# Altium project COMRAD_0v1.PrjPCB (part 2 of 5)

## Sheet ZYNQ_Power.SchDoc
size A3; DocumentNumber: 11; SheetNumber: 11; SheetTotal: 47
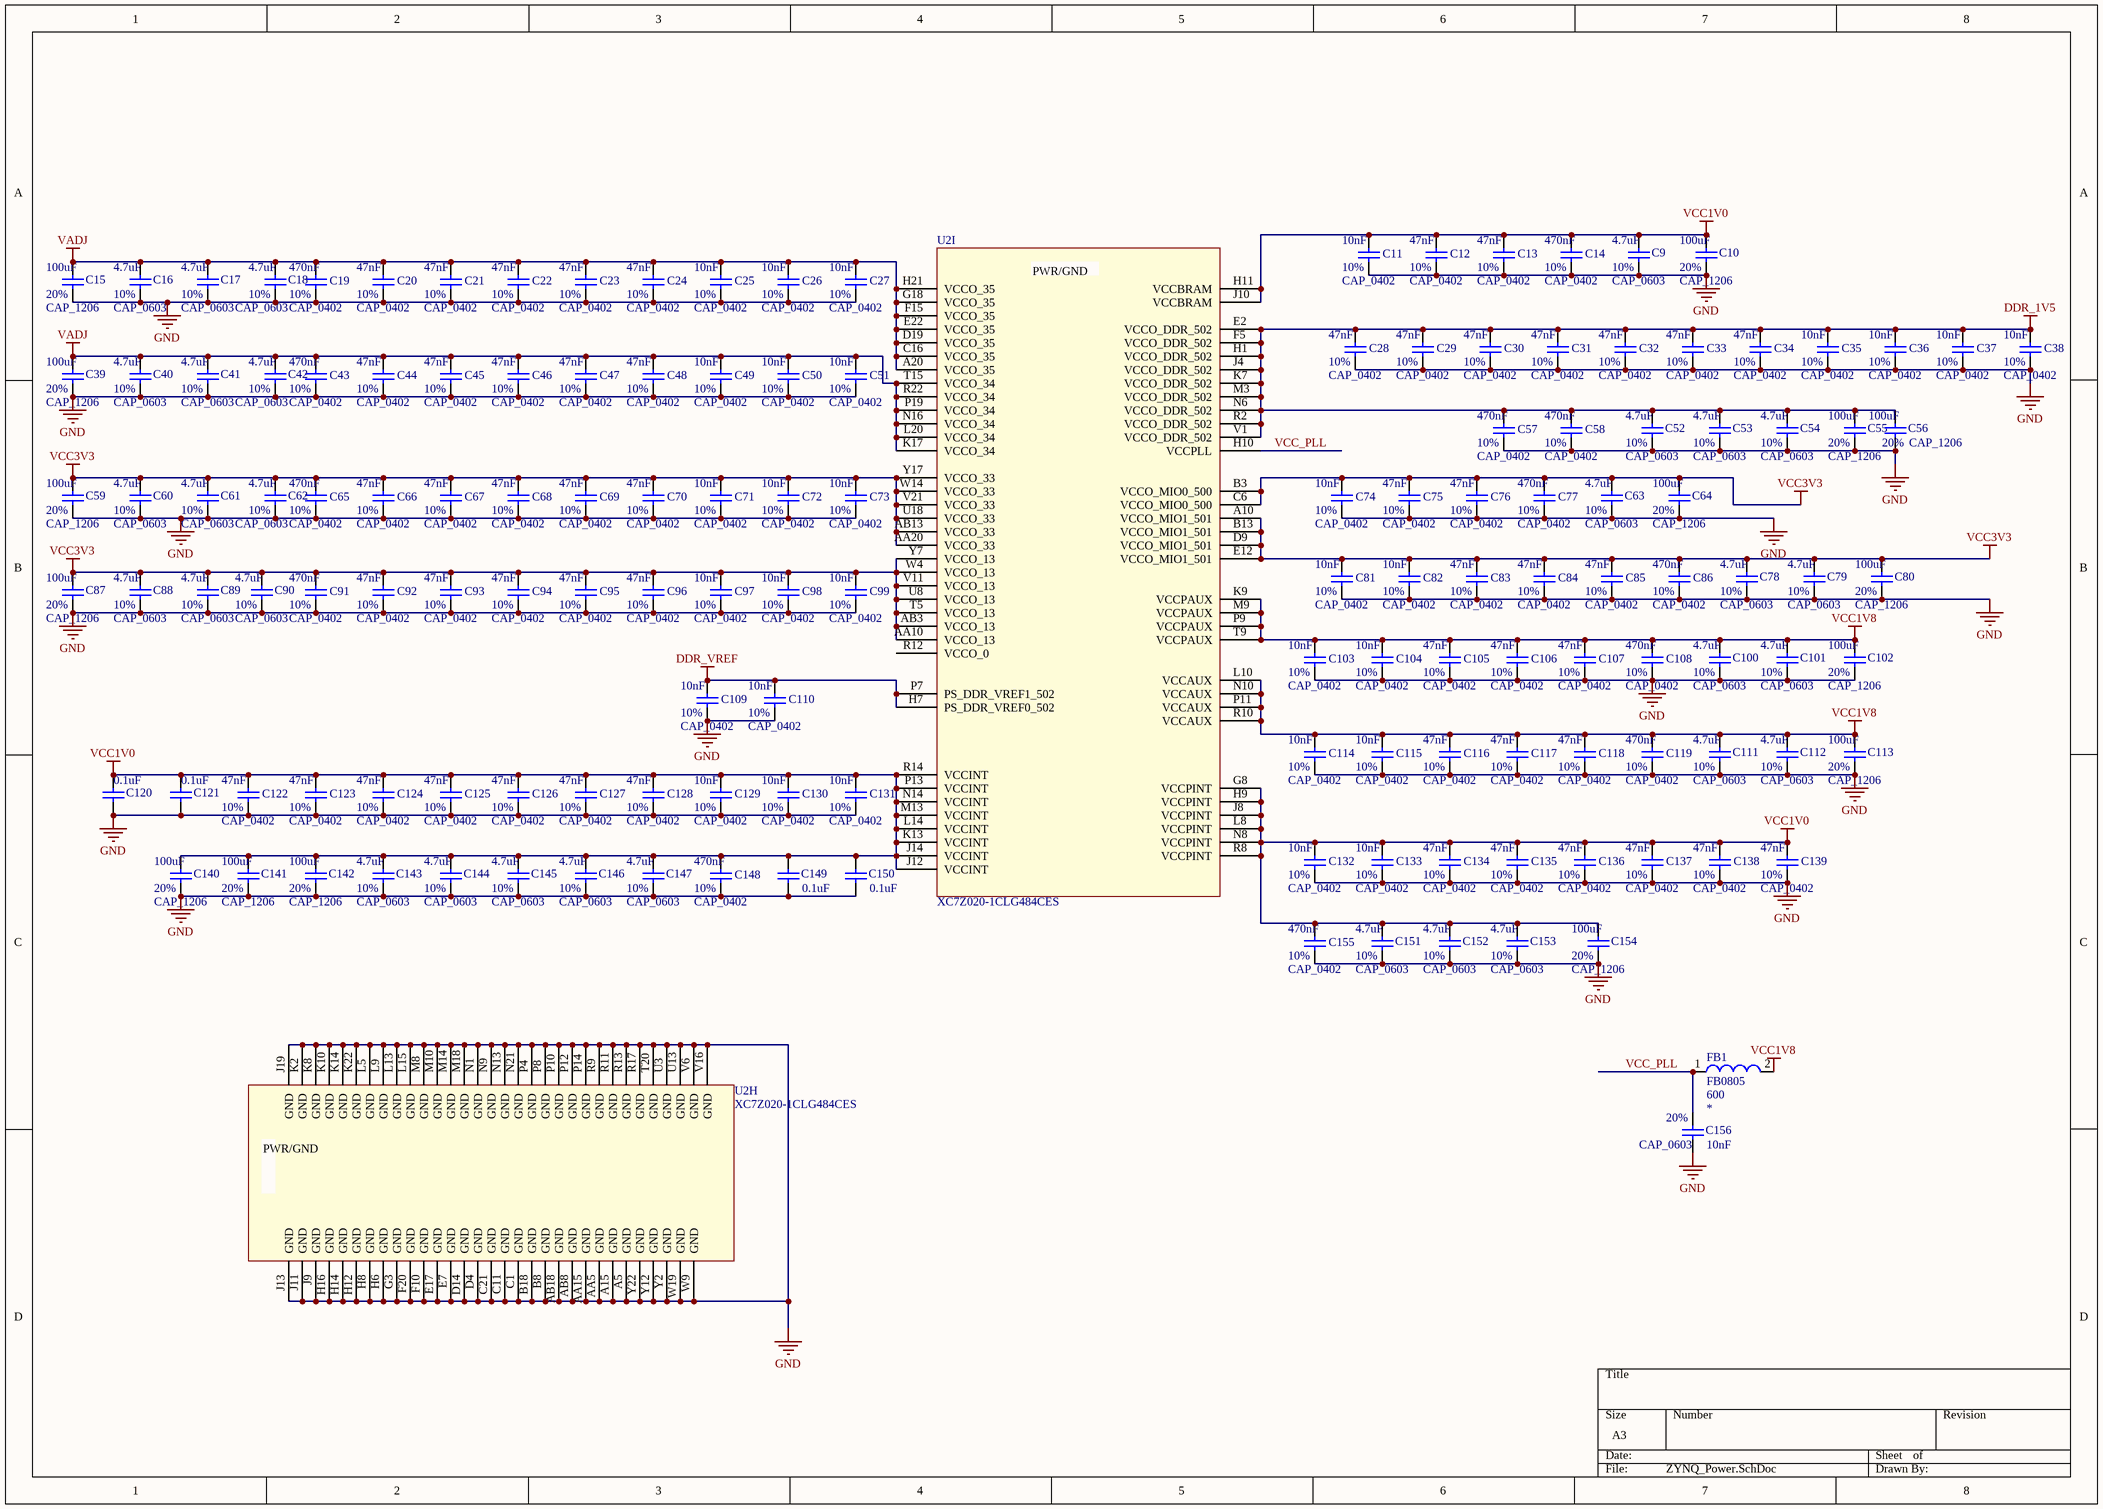
[diagram p9: ZYNQ_Power.SchDoc]

### Parts
C9  CAP_0603  value 4.7uF  Tolerance: 10%  [CAPC0603(1608)100_N]
C10  CAP_1206  value 100uF  Tolerance: 20%  [CAPC1206(3216)100_N]
C11  CAP_0402  value 10nF  Tolerance: 10%  [CAPC0402(1005)60_N]
C12  CAP_0402  value 47nF  Tolerance: 10%  [CAPC0402(1005)60_N]
C13  CAP_0402  value 47nF  Tolerance: 10%  [CAPC0402(1005)60_N]
C14  CAP_0402  value 470nF  Tolerance: 10%  [CAPC0402(1005)60_N]
C15  CAP_1206  value 100uF  Tolerance: 20%  [CAPC1206(3216)100_N]
C16  CAP_0603  value 4.7uF  Tolerance: 10%  [CAPC0603(1608)100_N]
C17  CAP_0603  value 4.7uF  Tolerance: 10%  [CAPC0603(1608)100_N]
C18  CAP_0603  value 4.7uF  Tolerance: 10%  [CAPC0603(1608)100_N]
C19  CAP_0402  value 470nF  Tolerance: 10%  [CAPC0402(1005)60_N]
C20  CAP_0402  value 47nF  Tolerance: 10%  [CAPC0402(1005)60_N]
C21  CAP_0402  value 47nF  Tolerance: 10%  [CAPC0402(1005)60_N]
C22  CAP_0402  value 47nF  Tolerance: 10%  [CAPC0402(1005)60_N]
C23  CAP_0402  value 47nF  Tolerance: 10%  [CAPC0402(1005)60_N]
C24  CAP_0402  value 47nF  Tolerance: 10%  [CAPC0402(1005)60_N]
C25  CAP_0402  value 10nF  Tolerance: 10%  [CAPC0402(1005)60_N]
C26  CAP_0402  value 10nF  Tolerance: 10%  [CAPC0402(1005)60_N]
C27  CAP_0402  value 10nF  Tolerance: 10%  [CAPC0402(1005)60_N]
C28  CAP_0402  value 47nF  Tolerance: 10%  [CAPC0402(1005)60_N]
C29  CAP_0402  value 47nF  Tolerance: 10%  [CAPC0402(1005)60_N]
C30  CAP_0402  value 47nF  Tolerance: 10%  [CAPC0402(1005)60_N]
C31  CAP_0402  value 47nF  Tolerance: 10%  [CAPC0402(1005)60_N]
C32  CAP_0402  value 47nF  Tolerance: 10%  [CAPC0402(1005)60_N]
C33  CAP_0402  value 47nF  Tolerance: 10%  [CAPC0402(1005)60_N]
C34  CAP_0402  value 47nF  Tolerance: 10%  [CAPC0402(1005)60_N]
C35  CAP_0402  value 10nF  Tolerance: 10%  [CAPC0402(1005)60_N]
C36  CAP_0402  value 10nF  Tolerance: 10%  [CAPC0402(1005)60_N]
C37  CAP_0402  value 10nF  Tolerance: 10%  [CAPC0402(1005)60_N]
C38  CAP_0402  value 10nF  Tolerance: 10%  [CAPC0402(1005)60_N]
C39  CAP_1206  value 100uF  Tolerance: 20%  [CAPC1206(3216)100_N]
C40  CAP_0603  value 4.7uF  Tolerance: 10%  [CAPC0603(1608)100_N]
C41  CAP_0603  value 4.7uF  Tolerance: 10%  [CAPC0603(1608)100_N]
C42  CAP_0603  value 4.7uF  Tolerance: 10%  [CAPC0603(1608)100_N]
C43  CAP_0402  value 470nF  Tolerance: 10%  [CAPC0402(1005)60_N]
C44  CAP_0402  value 47nF  Tolerance: 10%  [CAPC0402(1005)60_N]
C45  CAP_0402  value 47nF  Tolerance: 10%  [CAPC0402(1005)60_N]
C46  CAP_0402  value 47nF  Tolerance: 10%  [CAPC0402(1005)60_N]
C47  CAP_0402  value 47nF  Tolerance: 10%  [CAPC0402(1005)60_N]
C48  CAP_0402  value 47nF  Tolerance: 10%  [CAPC0402(1005)60_N]
C49  CAP_0402  value 10nF  Tolerance: 10%  [CAPC0402(1005)60_N]
C50  CAP_0402  value 10nF  Tolerance: 10%  [CAPC0402(1005)60_N]
C51  CAP_0402  value 10nF  Tolerance: 10%  [CAPC0402(1005)60_N]
C52  CAP_0603  value 4.7uF  Tolerance: 10%  [CAPC0603(1608)100_N]
C53  CAP_0603  value 4.7uF  Tolerance: 10%  [CAPC0603(1608)100_N]
C54  CAP_0603  value 4.7uF  Tolerance: 10%  [CAPC0603(1608)100_N]
C55  CAP_1206  value 100uF  Tolerance: 20%  [CAPC1206(3216)100_N]
C56  CAP_1206  value 100uF  Tolerance: 20%  [CAPC1206(3216)100_N]
C57  CAP_0402  value 470nF  Tolerance: 10%  [CAPC0402(1005)60_N]
C58  CAP_0402  value 470nF  Tolerance: 10%  [CAPC0402(1005)60_N]
C59  CAP_1206  value 100uF  Tolerance: 20%  [CAPC1206(3216)100_N]
C60  CAP_0603  value 4.7uF  Tolerance: 10%  [CAPC0603(1608)100_N]
C61  CAP_0603  value 4.7uF  Tolerance: 10%  [CAPC0603(1608)100_N]
C62  CAP_0603  value 4.7uF  Tolerance: 10%  [CAPC0603(1608)100_N]
C63  CAP_0603  value 4.7uF  Tolerance: 10%  [CAPC0603(1608)100_N]
C64  CAP_1206  value 100uF  Tolerance: 20%  [CAPC1206(3216)100_N]
C65  CAP_0402  value 470nF  Tolerance: 10%  [CAPC0402(1005)60_N]
C66  CAP_0402  value 47nF  Tolerance: 10%  [CAPC0402(1005)60_N]
C67  CAP_0402  value 47nF  Tolerance: 10%  [CAPC0402(1005)60_N]
C68  CAP_0402  value 47nF  Tolerance: 10%  [CAPC0402(1005)60_N]
C69  CAP_0402  value 47nF  Tolerance: 10%  [CAPC0402(1005)60_N]
C70  CAP_0402  value 47nF  Tolerance: 10%  [CAPC0402(1005)60_N]
C71  CAP_0402  value 10nF  Tolerance: 10%  [CAPC0402(1005)60_N]
C72  CAP_0402  value 10nF  Tolerance: 10%  [CAPC0402(1005)60_N]
C73  CAP_0402  value 10nF  Tolerance: 10%  [CAPC0402(1005)60_N]
C74  CAP_0402  value 10nF  Tolerance: 10%  [CAPC0402(1005)60_N]
C75  CAP_0402  value 47nF  Tolerance: 10%  [CAPC0402(1005)60_N]
C76  CAP_0402  value 47nF  Tolerance: 10%  [CAPC0402(1005)60_N]
C77  CAP_0402  value 470nF  Tolerance: 10%  [CAPC0402(1005)60_N]
C78  CAP_0603  value 4.7uF  Tolerance: 10%  [CAPC0603(1608)100_N]
C79  CAP_0603  value 4.7uF  Tolerance: 10%  [CAPC0603(1608)100_N]
C80  CAP_1206  value 100uF  Tolerance: 20%  [CAPC1206(3216)100_N]
C81  CAP_0402  value 10nF  Tolerance: 10%  [CAPC0402(1005)60_N]
C82  CAP_0402  value 10nF  Tolerance: 10%  [CAPC0402(1005)60_N]
C83  CAP_0402  value 47nF  Tolerance: 10%  [CAPC0402(1005)60_N]
C84  CAP_0402  value 47nF  Tolerance: 10%  [CAPC0402(1005)60_N]
C85  CAP_0402  value 47nF  Tolerance: 10%  [CAPC0402(1005)60_N]
C86  CAP_0402  value 470nF  Tolerance: 10%  [CAPC0402(1005)60_N]
C87  CAP_1206  value 100uF  Tolerance: 20%  [CAPC1206(3216)100_N]
C88  CAP_0603  value 4.7uF  Tolerance: 10%  [CAPC0603(1608)100_N]
C89  CAP_0603  value 4.7uF  Tolerance: 10%  [CAPC0603(1608)100_N]
C90  CAP_0603  value 4.7uF  Tolerance: 10%  [CAPC0603(1608)100_N]
C91  CAP_0402  value 470nF  Tolerance: 10%  [CAPC0402(1005)60_N]
C92  CAP_0402  value 47nF  Tolerance: 10%  [CAPC0402(1005)60_N]
C93  CAP_0402  value 47nF  Tolerance: 10%  [CAPC0402(1005)60_N]
C94  CAP_0402  value 47nF  Tolerance: 10%  [CAPC0402(1005)60_N]
C95  CAP_0402  value 47nF  Tolerance: 10%  [CAPC0402(1005)60_N]
C96  CAP_0402  value 47nF  Tolerance: 10%  [CAPC0402(1005)60_N]
C97  CAP_0402  value 10nF  Tolerance: 10%  [CAPC0402(1005)60_N]
C98  CAP_0402  value 10nF  Tolerance: 10%  [CAPC0402(1005)60_N]
C99  CAP_0402  value 10nF  Tolerance: 10%  [CAPC0402(1005)60_N]
C100  CAP_0603  value 4.7uF  Tolerance: 10%  [CAPC0603(1608)100_N]
C101  CAP_0603  value 4.7uF  Tolerance: 10%  [CAPC0603(1608)100_N]
C102  CAP_1206  value 100uF  Tolerance: 20%  [CAPC1206(3216)100_N]
C103  CAP_0402  value 10nF  Tolerance: 10%  [CAPC0402(1005)60_N]
C104  CAP_0402  value 10nF  Tolerance: 10%  [CAPC0402(1005)60_N]
C105  CAP_0402  value 47nF  Tolerance: 10%  [CAPC0402(1005)60_N]
C106  CAP_0402  value 47nF  Tolerance: 10%  [CAPC0402(1005)60_N]
C107  CAP_0402  value 47nF  Tolerance: 10%  [CAPC0402(1005)60_N]
C108  CAP_0402  value 470nF  Tolerance: 10%  [CAPC0402(1005)60_N]
C109  CAP_0402  value 10nF  Tolerance: 10%  [CAPC0402(1005)60_N]
C110  CAP_0402  value 10nF  Tolerance: 10%  [CAPC0402(1005)60_N]
C111  CAP_0603  value 4.7uF  Tolerance: 10%  [CAPC0603(1608)100_N]
C112  CAP_0603  value 4.7uF  Tolerance: 10%  [CAPC0603(1608)100_N]
C113  CAP_1206  value 100uF  Tolerance: 20%  [CAPC1206(3216)100_N]
C114  CAP_0402  value 10nF  Tolerance: 10%  [CAPC0402(1005)60_N]
C115  CAP_0402  value 10nF  Tolerance: 10%  [CAPC0402(1005)60_N]
C116  CAP_0402  value 47nF  Tolerance: 10%  [CAPC0402(1005)60_N]
C117  CAP_0402  value 47nF  Tolerance: 10%  [CAPC0402(1005)60_N]
C118  CAP_0402  value 47nF  Tolerance: 10%  [CAPC0402(1005)60_N]
C119  CAP_0402  value 470nF  Tolerance: 10%  [CAPC0402(1005)60_N]
C120  value 0.1uF  [CAPC0402(1005)60_N]  (hidden comment: TMK105BJ104KV-F)
C121  value 0.1uF  [CAPC0402(1005)60_N]  (hidden comment: TMK105BJ104KV-F)
C122  CAP_0402  value 47nF  Tolerance: 10%  [CAPC0402(1005)60_N]
C123  CAP_0402  value 47nF  Tolerance: 10%  [CAPC0402(1005)60_N]
C124  CAP_0402  value 47nF  Tolerance: 10%  [CAPC0402(1005)60_N]
C125  CAP_0402  value 47nF  Tolerance: 10%  [CAPC0402(1005)60_N]
C126  CAP_0402  value 47nF  Tolerance: 10%  [CAPC0402(1005)60_N]
C127  CAP_0402  value 47nF  Tolerance: 10%  [CAPC0402(1005)60_N]
C128  CAP_0402  value 47nF  Tolerance: 10%  [CAPC0402(1005)60_N]
C129  CAP_0402  value 10nF  Tolerance: 10%  [CAPC0402(1005)60_N]
C130  CAP_0402  value 10nF  Tolerance: 10%  [CAPC0402(1005)60_N]
C131  CAP_0402  value 10nF  Tolerance: 10%  [CAPC0402(1005)60_N]
C132  CAP_0402  value 10nF  Tolerance: 10%  [CAPC0402(1005)60_N]
C133  CAP_0402  value 10nF  Tolerance: 10%  [CAPC0402(1005)60_N]
C134  CAP_0402  value 47nF  Tolerance: 10%  [CAPC0402(1005)60_N]
C135  CAP_0402  value 47nF  Tolerance: 10%  [CAPC0402(1005)60_N]
C136  CAP_0402  value 47nF  Tolerance: 10%  [CAPC0402(1005)60_N]
C137  CAP_0402  value 47nF  Tolerance: 10%  [CAPC0402(1005)60_N]
C138  CAP_0402  value 47nF  Tolerance: 10%  [CAPC0402(1005)60_N]
C139  CAP_0402  value 47nF  Tolerance: 10%  [CAPC0402(1005)60_N]
C140  CAP_1206  value 100uF  Tolerance: 20%  [CAPC1206(3216)100_N]
C141  CAP_1206  value 100uF  Tolerance: 20%  [CAPC1206(3216)100_N]
C142  CAP_1206  value 100uF  Tolerance: 20%  [CAPC1206(3216)100_N]
C143  CAP_0603  value 4.7uF  Tolerance: 10%  [CAPC0603(1608)100_N]
C144  CAP_0603  value 4.7uF  Tolerance: 10%  [CAPC0603(1608)100_N]
C145  CAP_0603  value 4.7uF  Tolerance: 10%  [CAPC0603(1608)100_N]
C146  CAP_0603  value 4.7uF  Tolerance: 10%  [CAPC0603(1608)100_N]
C147  CAP_0603  value 4.7uF  Tolerance: 10%  [CAPC0603(1608)100_N]
C148  CAP_0402  value 470nF  Tolerance: 10%  [CAPC0402(1005)60_N]
C149  value 0.1uF  [CAPC0402(1005)60_N]  (hidden comment: TMK105BJ104KV-F)
C150  value 0.1uF  [CAPC0402(1005)60_N]  (hidden comment: TMK105BJ104KV-F)
C151  CAP_0603  value 4.7uF  Tolerance: 10%  [CAPC0603(1608)100_N]
C152  CAP_0603  value 4.7uF  Tolerance: 10%  [CAPC0603(1608)100_N]
C153  CAP_0603  value 4.7uF  Tolerance: 10%  [CAPC0603(1608)100_N]
C154  CAP_1206  value 100uF  Tolerance: 20%  [CAPC1206(3216)100_N]
C155  CAP_0402  value 470nF  Tolerance: 10%  [CAPC0402(1005)60_N]
C156  CAP_0603  value 10nF  Tolerance: 20%  [CAPC0402(1005)60_N]
FB1  FB0805  Resistance: 600  [Inductor0805(2012)]
U2  XC7Z020-1CLG484CES  [ZYNQ_xc7z020clg484pkg_BGA-484]  (parts H,I of 10)

### Nets
DDR_1V5: C28.2 C29.2 C30.2 C31.2 C32.2 C33.2 C34.2 C35.2 C36.2 C37.2 C38.2 C52.2 C53.2 C54.2 C55.2 C56.2 C57.2 C58.2 U2.E2(VCCO_DDR_502) U2.F5(VCCO_DDR_502) U2.H1(VCCO_DDR_502) U2.J4(VCCO_DDR_502) U2.K7(VCCO_DDR_502) U2.M3(VCCO_DDR_502) U2.N6(VCCO_DDR_502) U2.R2(VCCO_DDR_502) U2.V1(VCCO_DDR_502)
DDR_VREF: C109.2 C110.2 U2.H7(PS_DDR_VREF0_502) U2.P7(PS_DDR_VREF1_502)
GND: C9.1 C10.1 C11.1 C12.1 C13.1 C14.1 C15.1 C16.1 C17.1 C18.1 C19.1 C20.1 C21.1 C22.1 C23.1 C24.1 C25.1 C26.1 C27.1 C28.1 C29.1 C30.1 C31.1 C32.1 C33.1 C34.1 C35.1 C36.1 C37.1 C38.1 C39.1 C40.1 C41.1 C42.1 C43.1 C44.1 C45.1 C46.1 C47.1 C48.1 C49.1 C50.1 C51.1 C52.1 C53.1 C54.1 C55.1 C56.1 C57.1 C58.1 C59.1 C60.1 C61.1 C62.1 C63.1 C64.1 C65.1 C66.1 C67.1 C68.1 C69.1 C70.1 C71.1 C72.1 C73.1 C74.1 C75.1 C76.1 C77.1 C78.1 C79.1 C80.1 C81.1 C82.1 C83.1 C84.1 C85.1 C86.1 C87.1 C88.1 C89.1 C90.1 C91.1 C92.1 C93.1 C94.1 C95.1 C96.1 C97.1 C98.1 C99.1 C100.1 C101.1 C102.1 C103.1 C104.1 C105.1 C106.1 C107.1 C108.1 C109.1 C110.1 C111.1 C112.1 C113.1 C114.1 C115.1 C116.1 C117.1 C118.1 C119.1 C120.1 C121.1 C122.1 C123.1 C124.1 C125.1 C126.1 C127.1 C128.1 C129.1 C130.1 C131.1 C132.1 C133.1 C134.1 C135.1 C136.1 C137.1 C138.1 C139.1 C140.1 C141.1 C142.1 C143.1 C144.1 C145.1 C146.1 C147.1 C148.1 C149.1 C150.1 C151.1 C152.1 C153.1 C154.1 C155.1 C156.1 U2.A5(GND) U2.A15(GND) U2.AA5(GND) U2.AA15(GND) U2.AB8(GND) U2.AB18(GND) U2.B8(GND) U2.B18(GND) U2.C1(GND) U2.C11(GND) U2.C21(GND) U2.D4(GND) U2.D14(GND) U2.E7(GND) U2.E17(GND) U2.F10(GND) U2.F20(GND) U2.G3(GND) U2.H6(GND) U2.H8(GND) U2.H12(GND) U2.H14(GND) U2.H16(GND) U2.J9(GND) U2.J11(GND) U2.J13(GND) U2.J19(GND) U2.K2(GND) U2.K8(GND) U2.K10(GND) U2.K14(GND) U2.K22(GND) U2.L5(GND) U2.L9(GND) U2.L13(GND) U2.L15(GND) U2.M8(GND) U2.M10(GND) U2.M14(GND) U2.M18(GND) U2.N1(GND) U2.N9(GND) U2.N13(GND) U2.N21(GND) U2.P4(GND) U2.P8(GND) U2.P10(GND) U2.P12(GND) U2.P14(GND) U2.R9(GND) U2.R11(GND) U2.R13(GND) U2.R17(GND) U2.T20(GND) U2.U3(GND) U2.U13(GND) U2.V6(GND) U2.V16(GND) U2.W9(GND) U2.W19(GND) U2.Y2(GND) U2.Y12(GND) U2.Y22(GND)
VADJ: C15.2 C16.2 C17.2 C18.2 C19.2 C20.2 C21.2 C22.2 C23.2 C24.2 C25.2 C26.2 C27.2 C39.2 C40.2 C41.2 C42.2 C43.2 C44.2 C45.2 C46.2 C47.2 C48.2 C49.2 C50.2 C51.2 U2.A20(VCCO_35) U2.C16(VCCO_35) U2.D19(VCCO_35) U2.E22(VCCO_35) U2.F15(VCCO_35) U2.G18(VCCO_35) U2.H21(VCCO_35) U2.K17(VCCO_34) U2.L20(VCCO_34) U2.N16(VCCO_34) U2.P19(VCCO_34) U2.R22(VCCO_34) U2.T15(VCCO_34)
VCC1V0: C9.2 C10.2 C11.2 C12.2 C13.2 C14.2 C120.2 C121.2 C122.2 C123.2 C124.2 C125.2 C126.2 C127.2 C128.2 C129.2 C130.2 C131.2 C132.2 C133.2 C134.2 C135.2 C136.2 C137.2 C138.2 C139.2 C140.2 C141.2 C142.2 C143.2 C144.2 C145.2 C146.2 C147.2 C148.2 C149.2 C150.2 C151.2 C152.2 C153.2 C154.2 C155.2 U2.G8(VCCPINT) U2.H9(VCCPINT) U2.H11(VCCBRAM) U2.J8(VCCPINT) U2.J10(VCCBRAM) U2.J12(VCCINT) U2.J14(VCCINT) U2.K13(VCCINT) U2.L8(VCCPINT) U2.L14(VCCINT) U2.M13(VCCINT) U2.N8(VCCPINT) U2.N14(VCCINT) U2.P13(VCCINT) U2.R8(VCCPINT) U2.R14(VCCINT)
VCC1V8: C100.2 C101.2 C102.2 C103.2 C104.2 C105.2 C106.2 C107.2 C108.2 C111.2 C112.2 C113.2 C114.2 C115.2 C116.2 C117.2 C118.2 C119.2 FB1.2 U2.K9(VCCPAUX) U2.L10(VCCAUX) U2.M9(VCCPAUX) U2.N10(VCCAUX) U2.P9(VCCPAUX) U2.P11(VCCAUX) U2.R10(VCCAUX) U2.T9(VCCPAUX)  [project net A_VCC1V8]
VCC3V3: C59.2 C60.2 C61.2 C62.2 C63.2 C64.2 C65.2 C66.2 C67.2 C68.2 C69.2 C70.2 C71.2 C72.2 C73.2 C74.2 C75.2 C76.2 C77.2 C78.2 C79.2 C80.2 C81.2 C82.2 C83.2 C84.2 C85.2 C86.2 C87.2 C88.2 C89.2 C90.2 C91.2 C92.2 C93.2 C94.2 C95.2 C96.2 C97.2 C98.2 C99.2 U2.A10(VCCO_MIO1_501) U2.AA10(VCCO_13) U2.AA20(VCCO_33) U2.AB3(VCCO_13) U2.AB13(VCCO_33) U2.B3(VCCO_MIO0_500) U2.B13(VCCO_MIO1_501) U2.C6(VCCO_MIO0_500) U2.D9(VCCO_MIO1_501) U2.E12(VCCO_MIO1_501) U2.T5(VCCO_13) U2.U8(VCCO_13) U2.U18(VCCO_33) U2.V11(VCCO_13) U2.V21(VCCO_33) U2.W4(VCCO_13) U2.W14(VCCO_33) U2.Y7(VCCO_13) U2.Y17(VCCO_33)
VCC_PLL: C156.2 FB1.1 U2.H10(VCCPLL)

Not connected (* = marked no-connect by the designer): U2 R12(VCCO_0)

### Notes on the sheet
- (in symbol XC7Z020-1CLG484CES, part H) PWR/GND
- (in symbol XC7Z020-1CLG484CES, part I) PWR/GND

### Library data of the parts
C9 C16-C18 C40-C42 C52-C54 C60-C63 C78 C79 C88-C90 C100 C101 C111 C112 C143-C147 C151-C153 = CAP_0603: 4.7uF, ceramic, 10% 6.3V X5R Low ESR, 0603; Part Number: GRM188R60J475KE19D; Manufacturer: Murata Electronics North America; Footprint Ref: CAPC0603(1608)100_N; Library Ref: CAP_0603
C10 C15 C39 C55 C56 C59 C64 C80 C87 C102 C113 C140-C142 C154 = CAP_1206: CAP CER 100UF 6.3V 20% X5R 1206; Part Number: JMK316BJ107ML-T; Manufacturer: Taiyo Yuden; Footprint Ref: CAPC1206(3216)100_N; Library Ref: CAP_1206; Distributor: http://www.yuden.co.jp/productdata/catalog/en/mlcc01_e.pdf
C11 C25-C27 C35-C38 C49-C51 C71-C74 C81 C82 C97-C99 C103 C104 C109 C110 C114 C115 C129-C133 = CAP_0402: as C454 on sheet ZYNQ_MIOBank_500; Footprint Ref: CAPC0402(1005)60_N; Library Ref: CAP_0402
C12 C13 C20-C24 C28-C34 C44-C48 C66-C70 C75 C76 C83-C85 C92-C96 C105-C107 C116-C118 C122-C128 C134-C139 = CAP_0402: 0.047uF, ceramic, 10% 6.3V X5R, 0402; Part Number: GRM155R60J473KA01D; Manufacturer: Murata Electronics North America; Footprint Ref: CAPC0402(1005)60_N; Library Ref: CAP_0402
C14 C19 C43 C57 C58 C65 C77 C86 C91 C108 C119 C148 C155 = CAP_0402: 0.47uF, ceramic, 10% 6.3V X5R, 0402; Part Number: GRM155R60J474KE19D; Manufacturer: Murata Electronics North America; Footprint Ref: CAPC0402(1005)60_N; Library Ref: CAP_0402
C120 C121 C149 C150 = TMK105BJ104KV-F: 0.1uF, ceramic, 10%, 25V, X5R, 0402; Manufacturer: Taiyo Yuden; Tolerance: 10%; Part Number: TMK105BJ104KV-F
C156 = CAP_0603: 10000pF, ceramic, 10% 6.3V X5R, 0402; Part Number: GRM155R60J103KA01D; Manufacturer: Murata Electronics North America; Footprint Ref: CAPC0402(1005)60_N; Library Ref: CAP_0402
FB1 = FerriteBead0805: MPZ2012S601A, 600 ohm, 100MHz, 0805; Manufacturer: TDK Corporation; Value: 600; Max_Current: *; Part Number: MPZ2012S601A; Footprint Ref: Inductor0805(2012); Library Ref: FerriteBead0805
U2 = XC7Z020-1CLG484CES: as U2 on sheet ZYNQ_DDR3_Bank_502; Part Number: XC7Z020-1CLG484CES

## Sheet ZYNQ_CONFIG.SchDoc
size A4; DocumentNumber: 2; SheetNumber: 2; SheetTotal: 47
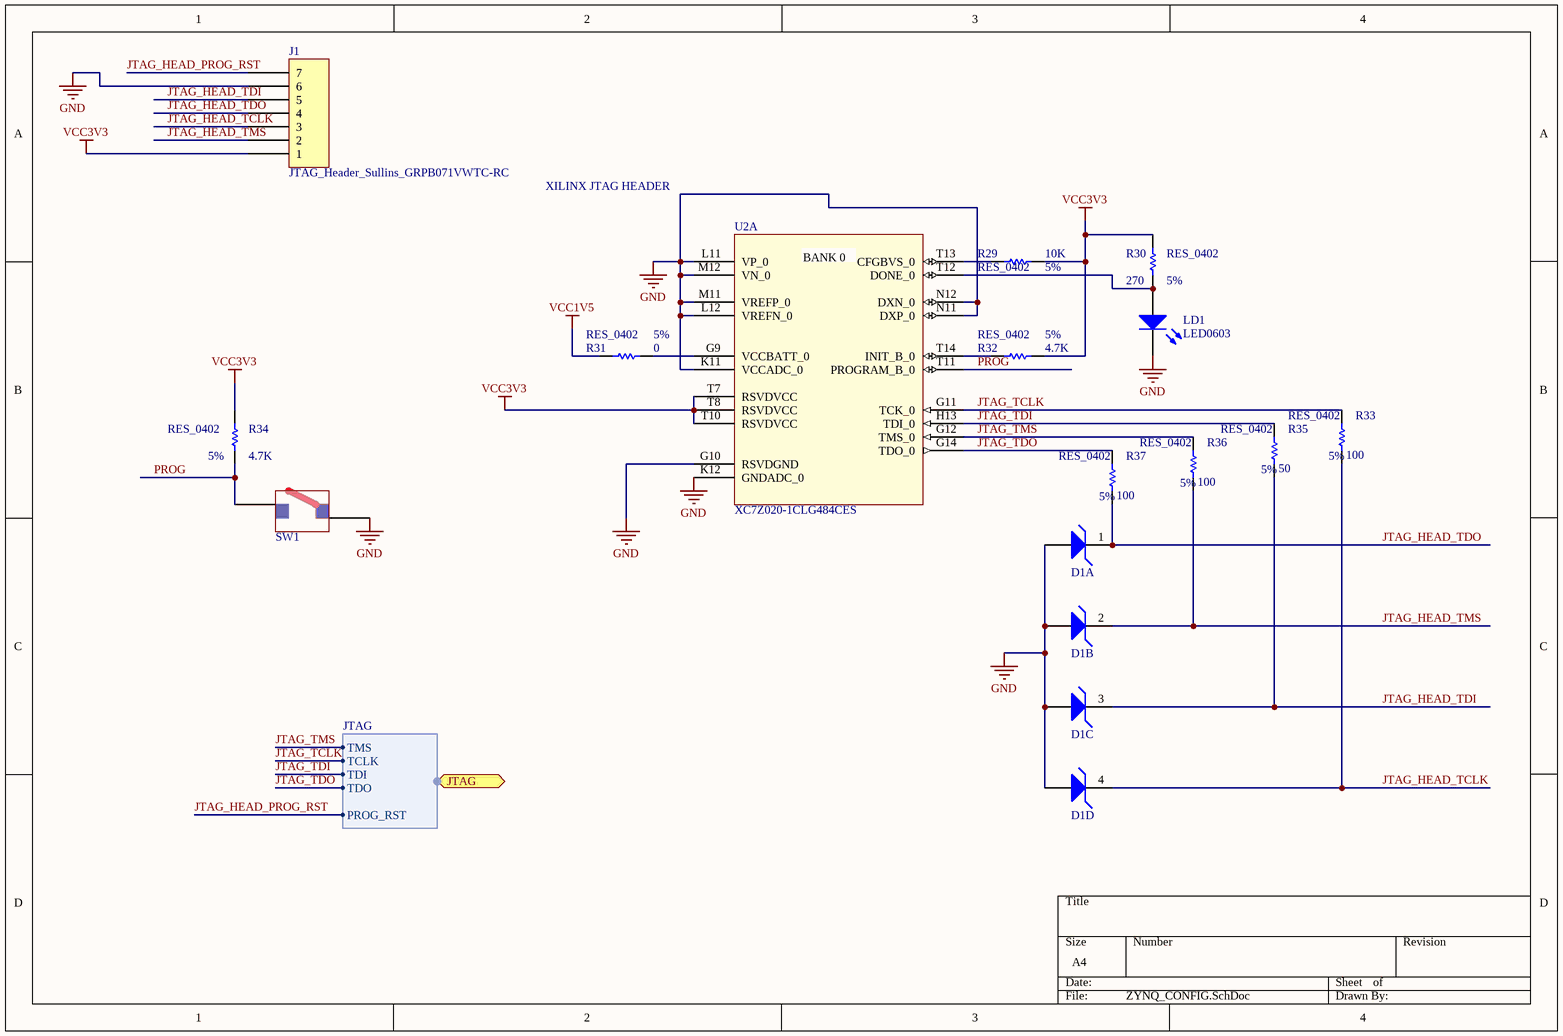
[diagram p10: ZYNQ_CONFIG.SchDoc]

### Parts
D1  QuadESDDiode_TEConnectivity_SESD0802Q4UG  [QuadESDDiode_TEConnectivity_SESD0802Q4UG_5-PIN]  (value not drawn)  (parts A,B,C,D of 4)
J1  JTAG_Header_Sullins_GRPB071VWTC-RC  [JTAG_Header_Sullins_GRPB071VWTC-RC_7-Pos]
LD1  LED0603  [LED0603(1608)]
R29  RES_0402  value 10K  Tolerance: 5%  [RESC0402(1005)_N]
R30  RES_0402  value 270  Tolerance: 5%  [RESC0402(1005)_N]
R31  RES_0402  value 0  Tolerance: 5%  [RESC0402(1005)_N]
R32  RES_0402  value 4.7K  Tolerance: 5%  [RESC0402(1005)_N]
R33  RES_0402  value 100  Tolerance: 5%  [RESC0402(1005)_N]
R34  RES_0402  value 4.7K  Tolerance: 5%  [RESC0402(1005)_N]
R35  RES_0402  value 50  Tolerance: 5%  [RESC0402(1005)_N]
R36  RES_0402  value 100  Tolerance: 5%  [RESC0402(1005)_N]
R37  RES_0402  value 100  Tolerance: 5%  [RESC0402(1005)_N]
SW1  CHS-01TB  [DIP_Switch_SPST_CopalElectronics_CHS-01TB]  (value not drawn)
U2  XC7Z020-1CLG484CES  [ZYNQ_xc7z020clg484pkg_BGA-484]  (part A of 10)

### Ports
JTAG (harness JTAG)

### Harnesses
JTAG: TMS, TCLK, TDI, TDO, PROG_RST

### Nets
GND: D1.G(A) J1.6 LD1.1(K) SW1.2 U2.G10(RSVDGND) U2.K11(VCCADC_0) U2.K12(GNDADC_0) U2.L11(VP_0) U2.L12(VREFN_0) U2.M11(VREFP_0) U2.M12(VN_0) U2.N11(DXP_0) U2.N12(DXN_0)
VCC1V5: R31.1
VCC3V3: J1.1 R29.2 R30.2 R32.2 R34.2 U2.T7(RSVDVCC) U2.T8(RSVDVCC) U2.T10(RSVDVCC)
JTAG_HEAD_PROG_RST: J1.7 ; port JTAG.PROG_RST
JTAG_HEAD_TCLK: D1.4(K) J1.3 R33.1
JTAG_HEAD_TDI: D1.3(K) J1.5 R35.1
JTAG_HEAD_TDO: D1.1(K) J1.4 R37.1
JTAG_HEAD_TMS: D1.2(K) J1.2 R36.1
JTAG_TCLK: R33.2 U2.G11(TCK_0) ; port JTAG.TCLK
JTAG_TDI: R35.2 U2.H13(TDI_0) ; port JTAG.TDI
JTAG_TDO: R37.2 U2.G14(TDO_0) ; port JTAG.TDO
JTAG_TMS: R36.2 U2.G12(TMS_0) ; port JTAG.TMS
PROG: R34.1 SW1.1 U2.T11(PROGRAM_B_0)
NetLD1_2: LD1.2(A) R30.1 U2.T12(DONE_0)
NetR29_1: R29.1 U2.T13(CFGBVS_0)
NetR31_2: R31.2 U2.G9(VCCBATT_0)
NetR32_1: R32.1 U2.T14(INIT_B_0)

### Notes on the sheet
- XILINX JTAG HEADER
- (in symbol XC7Z020-1CLG484CES, part A) BANK 0

### Library data of the parts
D1 = RF2197-000: SESD0802Q4UG, Quad Diode Array for ESD protection; Part Number: RF2197-000; Manufacturer: TE Connectivity
J1 = GRPB071VWTC-RC: CONN HEADER .050" 7POS SMD GOLD; Manufacturer: Sullins Connector Solutions; Part Number: GRPB071VWTC-RC
LD1 = LED0603: LED 565NM GRN DIFF 0603 SMD; Part Number: SML-LX0603GW-TR; Manufacturer: Lumex Opto/Components Inc; Value: GREEN; Footprint Ref: LED0603(1608); Library Ref: LED0603
R29 = RES_0402: 10K ohm, 5%, 1/16W, 0402; Part Number: RC0402JR-0710KL; Manufacturer: Yageo America; Library Ref: RES_0402; Footprint Ref: RESC0402(1005)_N
R30 = RES_0402: 270 ohm, 5%, 1/16W, 0402; Part Number: RC0402JR-07270RL; Manufacturer: Yageo America; Library Ref: RES_0402; Footprint Ref: RESC0402(1005)_N
R31 = RES_0402: 0.0 ohm shunt, 5%, 1/16W, 0402; Part Number: RC0402JR-070RL; Manufacturer: Yageo America; Library Ref: RES_0402; Footprint Ref: RESC0402(1005)_N
R32 R34 = RES_0402: 4.7K ohm, 5%, 1/16W, 0402; Part Number: RC0402JR-074K7L; Manufacturer: Yageo America; Library Ref: RES_0402; Footprint Ref: RESC0402(1005)_N
R33 R36 R37 = RES_0402: 100 ohm, 5%, 1/16W, 0402; Part Number: RC0402JR-07100RL; Manufacturer: Yageo America; Library Ref: RES_0402; Footprint Ref: RESC0402(1005)_N
R35 = RES_0402: 50 ohm, 5% 50mW, 0402; Part Number: FC0402E50R0JTBST1; Manufacturer: VISHAY SILICONIX; Library Ref: RES_0402; Footprint Ref: RESC0402(1005)_N
SW1 = CHS-01TB: SWITCH DIP 1-POS SLIDE SMD; Manufacturer: Copal Electronics Inc; Part Number: CHS-01TB
U2 = XC7Z020-1CLG484CES: XC7Z020-1CLG484CES, Zynq-7000 All Programmable SoC; Manufacturer: Xilinx; Part Number: XC7Z020-1CLG484CES

## Sheet ETHERNET_TOP_LEVEL.SchDoc
size A4; DocumentNumber: 42; SheetNumber: 42; SheetTotal: 47
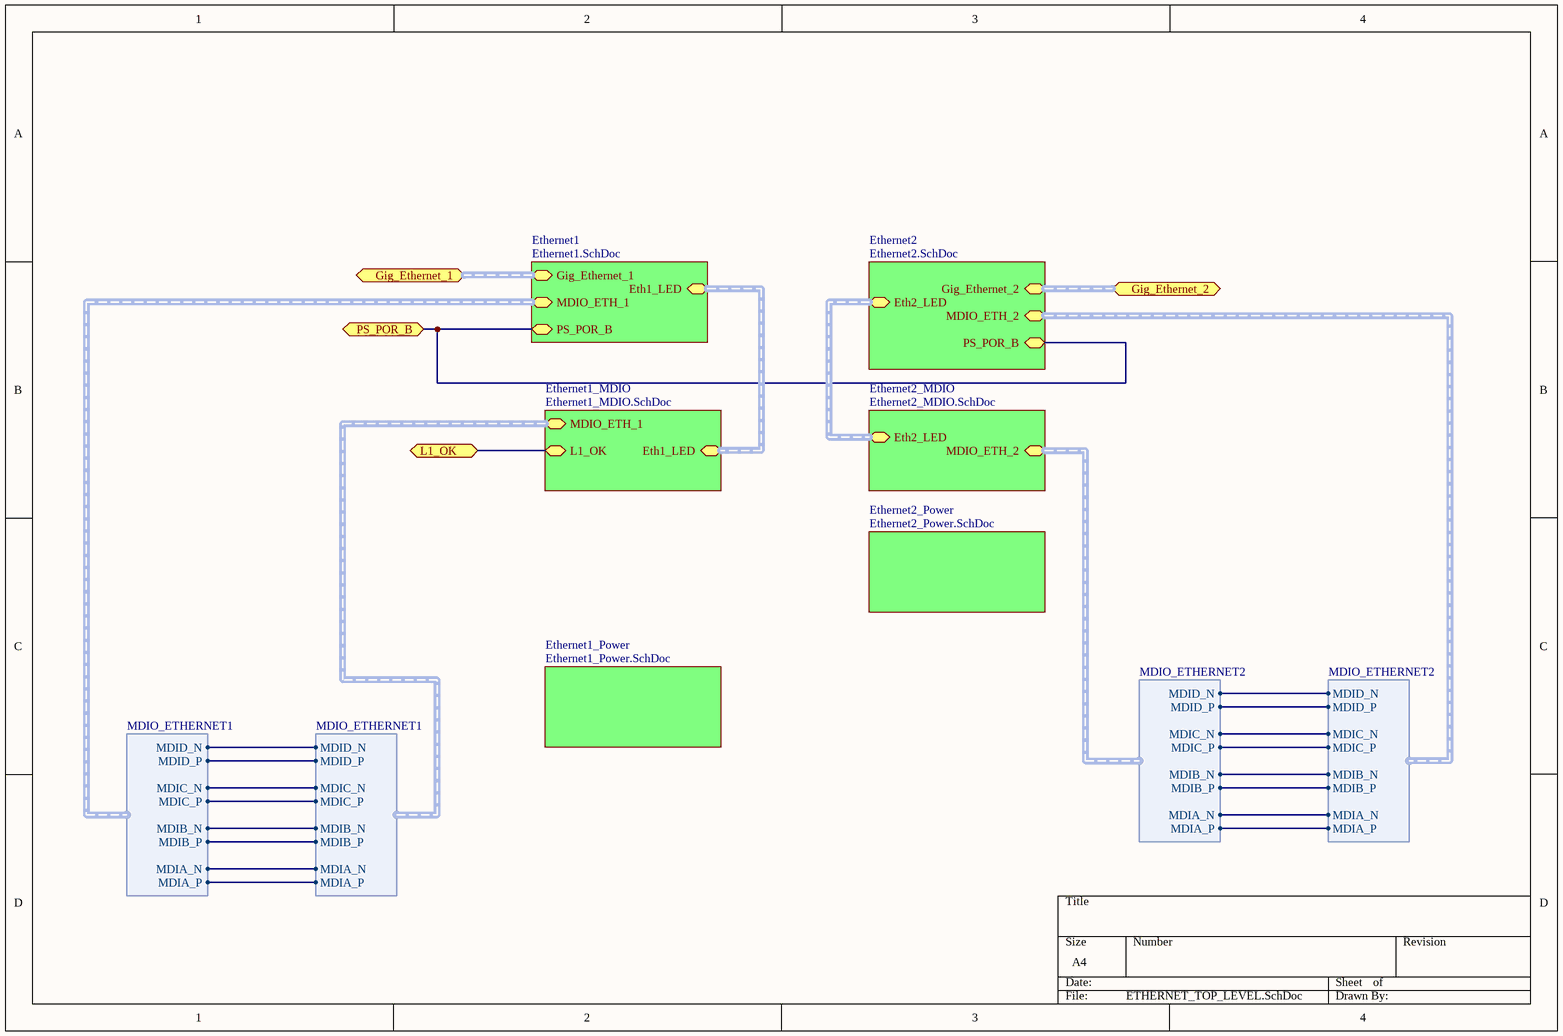
[diagram p11: ETHERNET_TOP_LEVEL.SchDoc]

### Sub-sheets
Ethernet1 = Ethernet1.SchDoc: Gig_Ethernet_1 (harness Gig_Ethernet1), MDIO_ETH_1 (harness MDIO_ETHERNET1), PS_POR_B (bidir), Eth1_LED (harness Eth1_LED)
Ethernet1_MDIO = Ethernet1_MDIO.SchDoc: MDIO_ETH_1 (harness MDIO_ETHERNET1), L1_OK, Eth1_LED (harness Eth1_LED)
Ethernet1_Power = Ethernet1_Power.SchDoc: no entries
Ethernet2 = Ethernet2.SchDoc: Gig_Ethernet_2 (harness Gig_Ethernet2), MDIO_ETH_2 (harness MDIO_ETHERNET2), PS_POR_B (bidir), Eth2_LED (harness Eth2_LED)
Ethernet2_MDIO = Ethernet2_MDIO.SchDoc: MDIO_ETH_2 (harness MDIO_ETHERNET2), Eth2_LED (harness Eth2_LED)
Ethernet2_Power = Ethernet2_Power.SchDoc: no entries

### Ports
Gig_Ethernet_1 (harness Gig_Ethernet1), Gig_Ethernet_2 (harness Gig_Ethernet2), L1_OK, PS_POR_B (bidir)

### Harnesses
MDIO_ETHERNET2: MDIA_P, MDIA_N, MDIB_P, MDIB_N, MDIC_P, MDIC_N, MDID_P, MDID_N
MDIO_ETHERNET1: MDIA_P, MDIA_N, MDIB_P, MDIB_N, MDIC_P, MDIC_N, MDID_P, MDID_N

### Nets
ETH2_MDIA_N: sheet Ethernet2/MDIO_ETH_2.MDIA_N, sheet Ethernet2_MDIO/MDIO_ETH_2.MDIA_N
ETH2_MDIA_P: sheet Ethernet2/MDIO_ETH_2.MDIA_P, sheet Ethernet2_MDIO/MDIO_ETH_2.MDIA_P
ETH2_MDIB_N: sheet Ethernet2/MDIO_ETH_2.MDIB_N, sheet Ethernet2_MDIO/MDIO_ETH_2.MDIB_N
ETH2_MDIB_P: sheet Ethernet2/MDIO_ETH_2.MDIB_P, sheet Ethernet2_MDIO/MDIO_ETH_2.MDIB_P
ETH2_MDIC_N: sheet Ethernet2/MDIO_ETH_2.MDIC_N, sheet Ethernet2_MDIO/MDIO_ETH_2.MDIC_N
ETH2_MDIC_P: sheet Ethernet2/MDIO_ETH_2.MDIC_P, sheet Ethernet2_MDIO/MDIO_ETH_2.MDIC_P
ETH2_MDID_N: sheet Ethernet2/MDIO_ETH_2.MDID_N, sheet Ethernet2_MDIO/MDIO_ETH_2.MDID_N
ETH2_MDID_P: sheet Ethernet2/MDIO_ETH_2.MDID_P, sheet Ethernet2_MDIO/MDIO_ETH_2.MDID_P
MDIA_N: sheet Ethernet1_MDIO/MDIO_ETH_1.MDIA_N, sheet Ethernet1/MDIO_ETH_1.MDIA_N
MDIA_P: sheet Ethernet1_MDIO/MDIO_ETH_1.MDIA_P, sheet Ethernet1/MDIO_ETH_1.MDIA_P
MDIB_N: sheet Ethernet1_MDIO/MDIO_ETH_1.MDIB_N, sheet Ethernet1/MDIO_ETH_1.MDIB_N
MDIB_P: sheet Ethernet1_MDIO/MDIO_ETH_1.MDIB_P, sheet Ethernet1/MDIO_ETH_1.MDIB_P
MDIC_N: sheet Ethernet1_MDIO/MDIO_ETH_1.MDIC_N, sheet Ethernet1/MDIO_ETH_1.MDIC_N
MDIC_P: sheet Ethernet1_MDIO/MDIO_ETH_1.MDIC_P, sheet Ethernet1/MDIO_ETH_1.MDIC_P
MDID_N: sheet Ethernet1_MDIO/MDIO_ETH_1.MDID_N, sheet Ethernet1/MDIO_ETH_1.MDID_N
MDID_P: sheet Ethernet1_MDIO/MDIO_ETH_1.MDID_P, sheet Ethernet1/MDIO_ETH_1.MDID_P
PS_POR_B: port PS_POR_B, sheet Ethernet1/PS_POR_B, sheet Ethernet2/PS_POR_B
NetJ11_2: port L1_OK, sheet Ethernet1_MDIO/L1_OK

### Buses and harness runs
harness port Gig_Ethernet_1 = sheet Ethernet1/Gig_Ethernet_1
harness port Gig_Ethernet_2 = sheet Ethernet2/Gig_Ethernet_2
harness sheet Ethernet1/Eth1_LED = sheet Ethernet1_MDIO/Eth1_LED
harness sheet Ethernet2/Eth2_LED = sheet Ethernet2_MDIO/Eth2_LED

## Sheet Ethernet1.SchDoc
size A4; DocumentNumber: 20; SheetNumber: 20; SheetTotal: 47
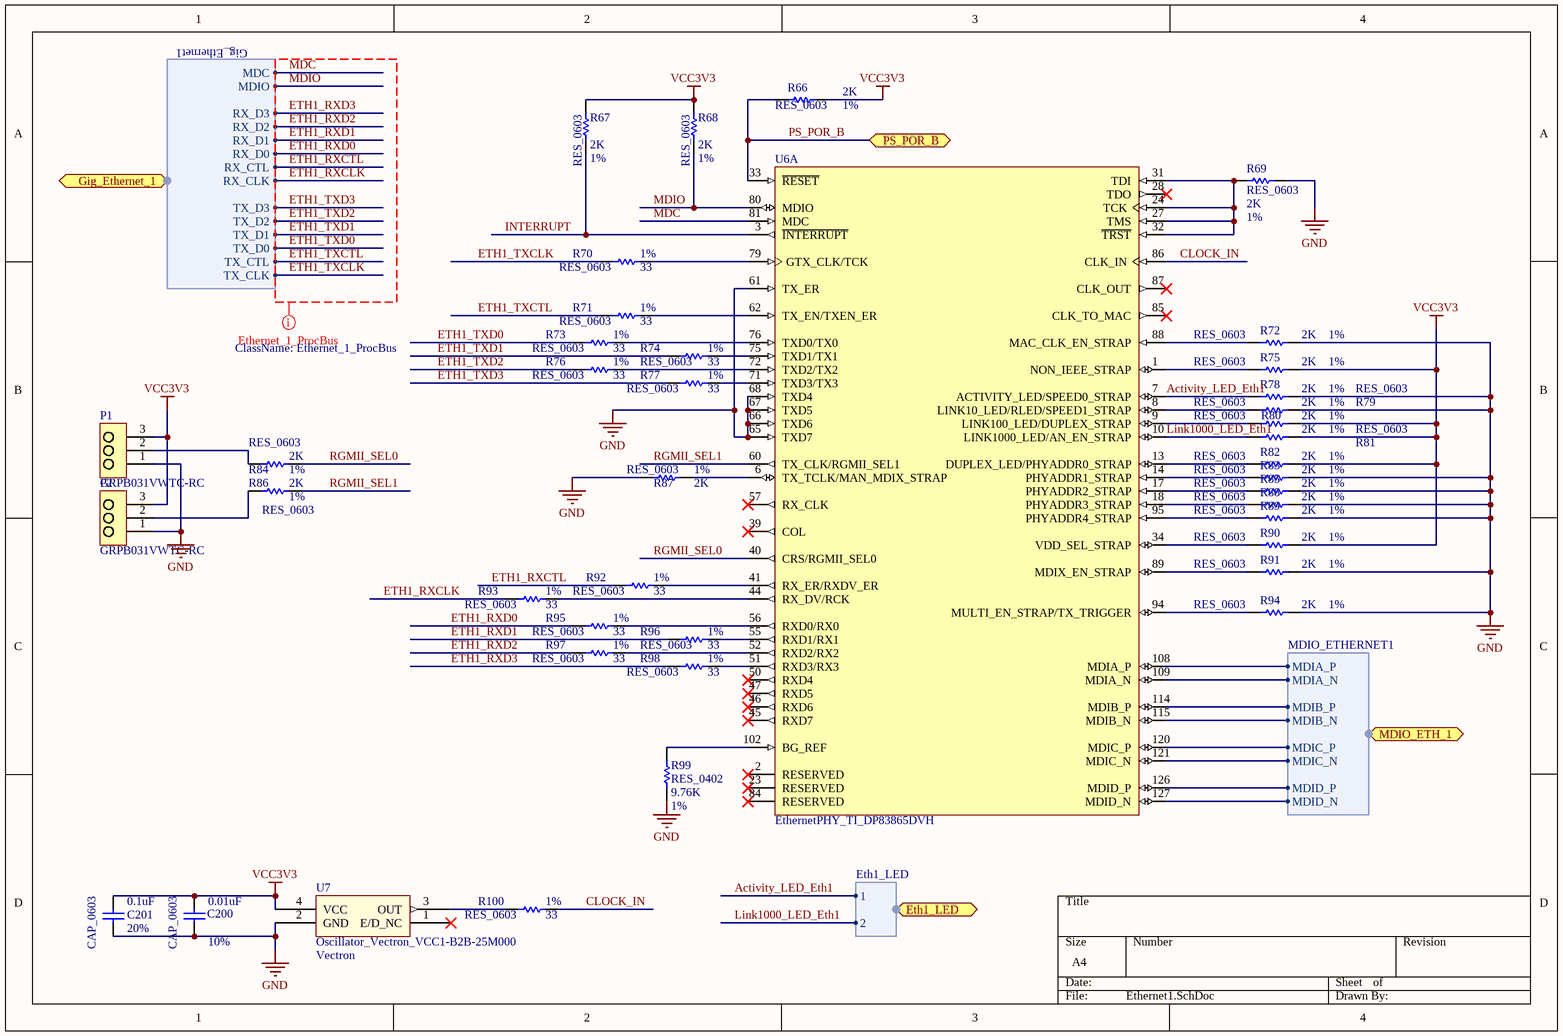
[diagram p12: Ethernet1.SchDoc]

### Parts
C200  CAP_0603  value 0.01uF  Tolerance: 10%  [CAPC0603(1608)100_N]
C201  CAP_0603  value 0.1uF  Tolerance: 20%  [CAPC0603(1608)100_N]
P1  GRPB031VWTC-RC  [Header_3-Pos_Sullins_GRPB031VWTC-RC]
P2  GRPB031VWTC-RC  [Header_3-Pos_Sullins_GRPB031VWTC-RC]
R66  RES_0603  value 2K  Tolerance: 1%  [RESC0603(1608)_N]
R67  RES_0603  value 2K  Tolerance: 1%  [RESC0603(1608)_N]
R68  RES_0603  value 2K  Tolerance: 1%  [RESC0603(1608)_N]
R69  RES_0603  value 2K  Tolerance: 1%  [RESC0603(1608)_N]
R70  RES_0603  value 33  Tolerance: 1%  [RESC0603(1608)_N]
R71  RES_0603  value 33  Tolerance: 1%  [RESC0603(1608)_N]
R72  RES_0603  value 2K  Tolerance: 1%  [RESC0603(1608)_N]
R73  RES_0603  value 33  Tolerance: 1%  [RESC0603(1608)_N]
R74  RES_0603  value 33  Tolerance: 1%  [RESC0603(1608)_N]
R75  RES_0603  value 2K  Tolerance: 1%  [RESC0603(1608)_N]
R76  RES_0603  value 33  Tolerance: 1%  [RESC0603(1608)_N]
R77  RES_0603  value 33  Tolerance: 1%  [RESC0603(1608)_N]
R78  RES_0603  value 2K  Tolerance: 1%  [RESC0603(1608)_N]
R79  RES_0603  value 2K  Tolerance: 1%  [RESC0603(1608)_N]
R80  RES_0603  value 2K  Tolerance: 1%  [RESC0603(1608)_N]
R81  RES_0603  value 2K  Tolerance: 1%  [RESC0603(1608)_N]
R82  RES_0603  value 2K  Tolerance: 1%  [RESC0603(1608)_N]
R83  RES_0603  value 2K  Tolerance: 1%  [RESC0603(1608)_N]
R84  RES_0603  value 2K  Tolerance: 1%  [RESC0603(1608)_N]
R85  RES_0603  value 2K  Tolerance: 1%  [RESC0603(1608)_N]
R86  RES_0603  value 2K  Tolerance: 1%  [RESC0603(1608)_N]
R87  RES_0603  value 2K  Tolerance: 1%  [RESC0603(1608)_N]
R88  RES_0603  value 2K  Tolerance: 1%  [RESC0603(1608)_N]
R89  RES_0603  value 2K  Tolerance: 1%  [RESC0603(1608)_N]
R90  RES_0603  value 2K  Tolerance: 1%  [RESC0603(1608)_N]
R91  RES_0603  value 2K  Tolerance: 1%  [RESC0603(1608)_N]
R92  RES_0603  value 33  Tolerance: 1%  [RESC0603(1608)_N]
R93  RES_0603  value 33  Tolerance: 1%  [RESC0603(1608)_N]
R94  RES_0603  value 2K  Tolerance: 1%  [RESC0603(1608)_N]
R95  RES_0603  value 33  Tolerance: 1%  [RESC0603(1608)_N]
R96  RES_0603  value 33  Tolerance: 1%  [RESC0603(1608)_N]
R97  RES_0603  value 33  Tolerance: 1%  [RESC0603(1608)_N]
R98  RES_0603  value 33  Tolerance: 1%  [RESC0603(1608)_N]
R99  RES_0402  value 9.76K  Tolerance: 1%  [RESC0402(1005)_N]
R100  RES_0603  value 33  Tolerance: 1%  [RESC0603(1608)_N]
U6  EthernetPHY_TI_DP83865DVH  [EthernetPHY_TI_DP83865(PQFP)_VLA128A_N]  (part A of 2)
U7  Oscillator_Vectron_VCC1-B2B-25M000  Manufacturer: Vectron  [Oscillator_Vectron_VCC1-B2B-25M000_SMD]

### Ports
Eth1_LED (harness Eth1_LED), Gig_Ethernet_1 (harness Gig_Ethernet1), MDIO_ETH_1 (harness MDIO_ETHERNET1), PS_POR_B (bidir)

### Harnesses
Gig_Ethernet1: TX_CLK, TX_CTL, TX_D0, TX_D1, TX_D2, TX_D3, RX_D0, RX_D1, RX_D2, RX_D3, RX_CLK, RX_CTL, MDIO, MDC
MDIO_ETHERNET1: MDIA_P, MDIA_N, MDIB_P, MDIB_N, MDIC_P, MDIC_N, MDID_P, MDID_N
Eth1_LED: 1, 2

### Nets
GND: C200.1 C201.2 P1.1 P2.1 R69.1 R72.1 R78.1 R79.1 R83.1 R85.1 R87.2 R88.1 R89.1 R91.1 R94.1 R99.1 U6.61(TX_ER) U6.65(TXD7) U6.66(TXD6) U6.67(TXD5) U6.68(TXD4) U7.2(GND)
VCC3V3: C200.2 C201.1 P1.3 P2.3 R66.1 R67.2 R68.2 R75.1 R80.1 R81.1 R82.1 R90.1 U7.4(VCC)
Activity_LED_Eth1: R78.2 U6.7(ACTIVITY_LED/SPEED0_STRAP) ; port Eth1_LED.1
CLOCK_IN: R100.2 U6.86(CLK_IN)
ETH1_RXCLK: R93.1 ; port Gig_Ethernet_1.RX_CLK
ETH1_RXCTL: R92.1 ; port Gig_Ethernet_1.RX_CTL
ETH1_RXD0: R95.1 ; port Gig_Ethernet_1.RX_D0
ETH1_RXD1: R96.1 ; port Gig_Ethernet_1.RX_D1
ETH1_RXD2: R97.1 ; port Gig_Ethernet_1.RX_D2
ETH1_RXD3: R98.1 ; port Gig_Ethernet_1.RX_D3
ETH1_TXCLK: R70.1 ; port Gig_Ethernet_1.TX_CLK
ETH1_TXCTL: R71.1 ; port Gig_Ethernet_1.TX_CTL
ETH1_TXD0: R73.1 ; port Gig_Ethernet_1.TX_D0
ETH1_TXD1: R74.1 ; port Gig_Ethernet_1.TX_D1
ETH1_TXD2: R76.1 ; port Gig_Ethernet_1.TX_D2
ETH1_TXD3: R77.1 ; port Gig_Ethernet_1.TX_D3
INTERRUPT: R67.1 U6.3(~{INTERRUPT})
Link1000_LED_Eth1: R81.2 U6.10(LINK1000_LED/AN_EN_STRAP) ; port Eth1_LED.2
MDC: U6.81(MDC) ; port Gig_Ethernet_1.MDC
MDIA_N: U6.109(MDIA_N) ; port MDIO_ETH_1.MDIA_N
MDIA_P: U6.108(MDIA_P) ; port MDIO_ETH_1.MDIA_P
MDIB_N: U6.115(MDIB_N) ; port MDIO_ETH_1.MDIB_N
MDIB_P: U6.114(MDIB_P) ; port MDIO_ETH_1.MDIB_P
MDIC_N: U6.121(MDIC_N) ; port MDIO_ETH_1.MDIC_N
MDIC_P: U6.120(MDIC_P) ; port MDIO_ETH_1.MDIC_P
MDID_N: U6.127(MDID_N) ; port MDIO_ETH_1.MDID_N
MDID_P: U6.126(MDID_P) ; port MDIO_ETH_1.MDID_P
MDIO: R68.1 U6.80(MDIO) ; port Gig_Ethernet_1.MDIO
PS_POR_B: R66.2 U6.33(~{RESET}) ; port PS_POR_B
RGMII_SEL0: R84.1 U6.40(CRS/RGMII_SEL0)
RGMII_SEL1: R86.1 U6.60(TX_CLK/RGMII_SEL1)
NetP1_2: P1.2 R84.2
NetP2_2: P2.2 R86.2
NetR69_2: R69.2 U6.24(TCK) U6.27(TMS) U6.31(TDI) U6.32(~{TRST})
NetR70_2: R70.2 U6.79(GTX_CLK/TCK)
NetR71_2: R71.2 U6.62(TX_EN/TXEN_ER)
NetR72_2: R72.2 U6.88(MAC_CLK_EN_STRAP)
NetR73_2: R73.2 U6.76(TXD0/TX0)
NetR74_2: R74.2 U6.75(TXD1/TX1)
NetR75_2: R75.2 U6.1(NON_IEEE_STRAP)
NetR76_2: R76.2 U6.72(TXD2/TX2)
NetR77_2: R77.2 U6.71(TXD3/TX3)
NetR79_2: R79.2 U6.8(LINK10_LED/RLED/SPEED1_STRAP)
NetR80_2: R80.2 U6.9(LINK100_LED/DUPLEX_STRAP)
NetR82_2: R82.2 U6.13(DUPLEX_LED/PHYADDR0_STRAP)
NetR83_2: R83.2 U6.14(PHYADDR1_STRAP)
NetR85_2: R85.2 U6.17(PHYADDR2_STRAP)
NetR87_1: R87.1 U6.6(TX_TCLK/MAN_MDIX_STRAP)
NetR88_2: R88.2 U6.18(PHYADDR3_STRAP)
NetR89_2: R89.2 U6.95(PHYADDR4_STRAP)
NetR90_2: R90.2 U6.34(VDD_SEL_STRAP)
NetR91_2: R91.2 U6.89(MDIX_EN_STRAP)
NetR92_2: R92.2 U6.41(RX_ER/RXDV_ER)
NetR93_2: R93.2 U6.44(RX_DV/RCK)
NetR94_2: R94.2 U6.94(MULTI_EN_STRAP/TX_TRIGGER)
NetR95_2: R95.2 U6.56(RXD0/RX0)
NetR96_2: R96.2 U6.55(RXD1/RX1)
NetR97_2: R97.2 U6.52(RXD2/RX2)
NetR98_2: R98.2 U6.51(RXD3/RX3)
NetR99_2: R99.2 U6.102(BG_REF)
NetR100_1: R100.1 U7.3(OUT)

Not connected (* = marked no-connect by the designer): U6 2(RESERVED)* 23(RESERVED)* 28(TDO)* 39(COL)* 45(RXD7)* 46(RXD6)* 47(RXD5)* 50(RXD4)* 57(RX_CLK)* 84(RESERVED)* 85(CLK_TO_MAC)* 87(CLK_OUT)*; U7 1(E/D_NC)*

### Layout directives
net class Ethernet_1_ProcBus: ETH1_RXCLK, ETH1_RXCTL, ETH1_RXD0, ETH1_RXD1, ETH1_RXD2, ETH1_RXD3, ETH1_TXCLK, ETH1_TXCTL, ETH1_TXD0, ETH1_TXD1, ETH1_TXD2, ETH1_TXD3, MDC, MDIO

### Library data of the parts
C200 = C0603C103K9RACTU: CAP CER 10000PF 6.3V X7R 0603; Manufacturer: Kemet; Part Number: C0603C103K9RACTU; Footprint Ref: CAPC0603(1608)100_N; Library Ref: CAP_0603
C201 = 6R3X14W104MV4T: CAP CER 0.1UF 6.3V 20% X7R 0603; Manufacturer: Johanson Dielectrics Inc; Part Number: 6R3X14W104MV4T; Footprint Ref: CAPC0603(1608)100_N; Library Ref: CAP_0603
P1 P2 = GRPB031VWTC-RC: CONN HEADER .050" 3POS SMD GOLD; Manufacturer: Sullins Connector Solutions; Part Number: GRPB031VWTC-RC
R66-R69 R72 R75 R78-R91 R94 = ERJ-3EKF2001V: RES 2.00K OHM 1/10W 1% 0603 SMD; Manufacturer: Panasonic Electronics Components; Part Number: ERJ-3EKF2001V; Footprint Ref: RESC0603(1608)_N; Library Ref: RES_0603
R70 R71 R73 R74 R76 R77 R92 R93 R95-R98 R100 = ERJ-3EKF33R0V: RES 33.0 OHM 1/10W 1% 0603 SMD; Manufacturer: Panasonic Electronics Components; Part Number: ERJ-3EKF33R0V; Footprint Ref: RESC0603(1608)_N; Library Ref: RES_0603
R99 = CRCW04029K76FKED: 9.76K ohm, 1% 1/16W, 0402; Manufacturer: Vishay/Dale; Part Number: CRCW04029K76FKED; Footprint Ref: RESC0402(1005)_N; Library Ref: RES_0402
U6 = DP83865DVH: Ethernet PHY_TI_DP83865DVH, Gigabit Ethernet PHYTER,128 Lead Plastic Flat Pack; Manufacturer: Texas Instruments; Part Number: DP83865DVH
U7 = VCC1-B2B-25M000: VCC1-B2B-25M000, 25MHz, 3.3V +/- 10%, No tri-state, +/-50 ppm, -40 to +85 deg; Part Number: VCC1-B2B-25M000; Footprint Ref: Oscillator_Vectron_VCC1-B2B-25M000_SMD; Library Ref: Oscillator_Vectron_VCC1-B2B-25M000

## Sheet Ethernet1_MDIO.SchDoc
size A4; DocumentNumber: 21; SheetNumber: 21; SheetTotal: 47
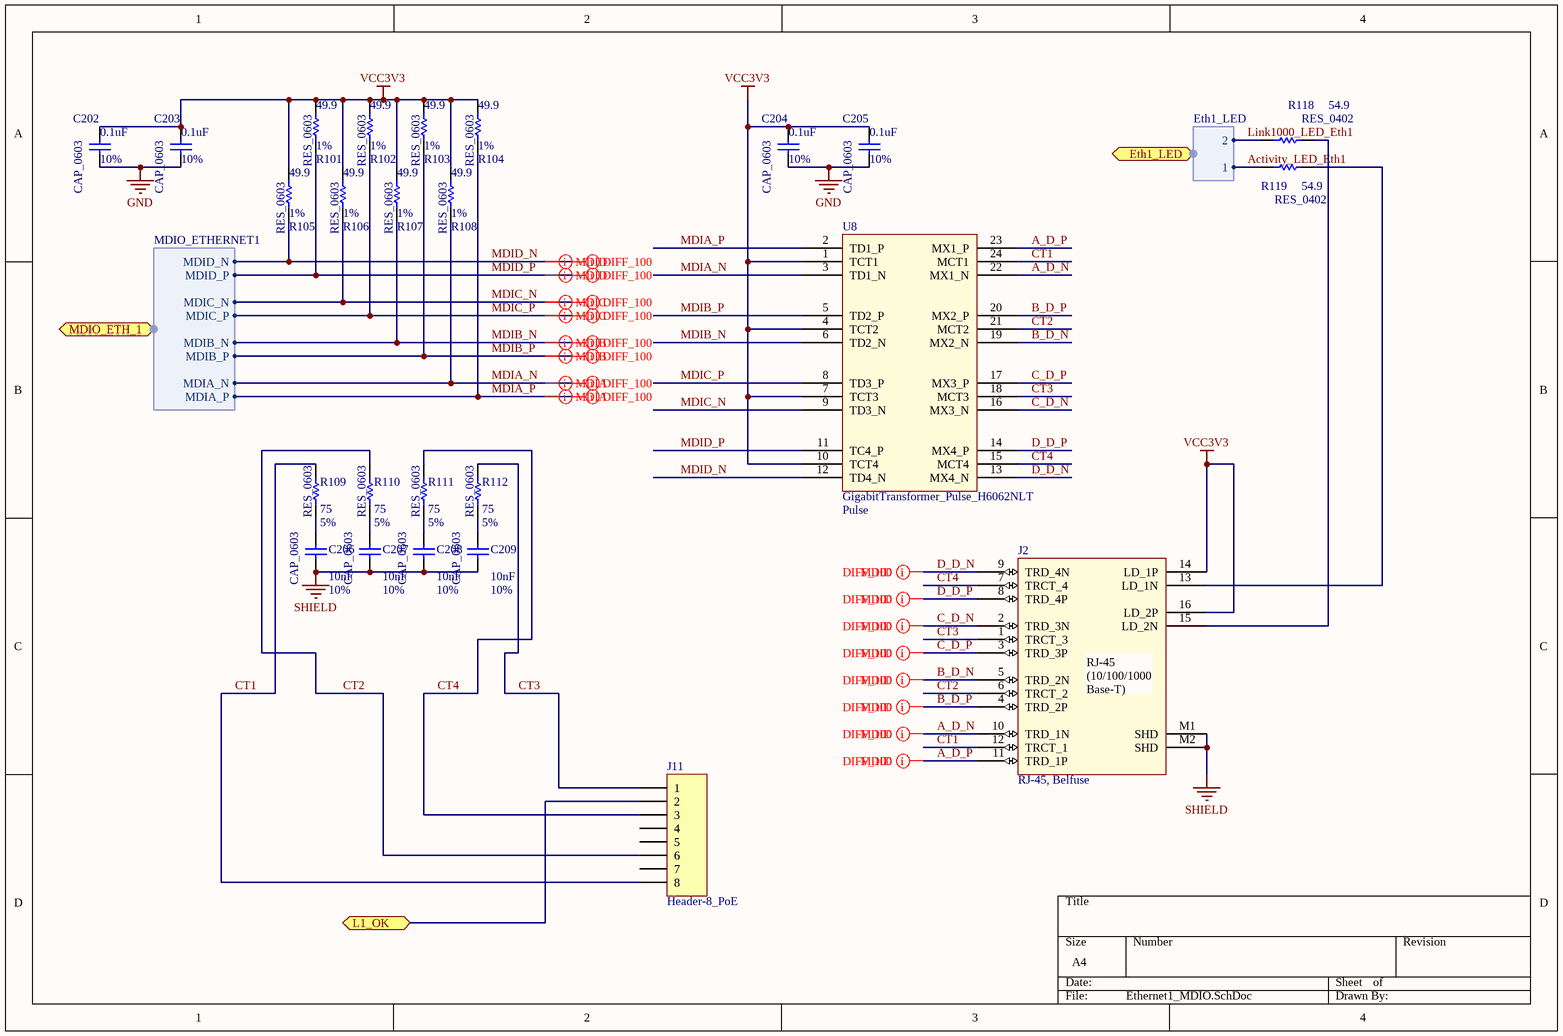
[diagram p13: Ethernet1_MDIO.SchDoc]

### Parts
C202  CAP_0603  value 0.1uF  Tolerance: 10%  [CAPC0603(1608)100_N]
C203  CAP_0603  value 0.1uF  Tolerance: 10%  [CAPC0603(1608)100_N]
C204  CAP_0603  value 0.1uF  Tolerance: 10%  [CAPC0603(1608)100_N]
C205  CAP_0603  value 0.1uF  Tolerance: 10%  [CAPC0603(1608)100_N]
C206  CAP_0603  value 10nF  Tolerance: 10%  [CAPC0603(1608)100_N]
C207  CAP_0603  value 10nF  Tolerance: 10%  [CAPC0603(1608)100_N]
C208  CAP_0603  value 10nF  Tolerance: 10%  [CAPC0603(1608)100_N]
C209  CAP_0603  value 10nF  Tolerance: 10%  [CAPC0603(1608)100_N]
J2  RJ-45, Belfuse  [RJ-45_BelFuse_L834-1G1T-S7_pcb]
J11  Header-8_PoE  [Header_FCI_20021221-00008T4LF_8-pos]
R101  RES_0603  value 49.9  Tolerance: 1%  [RESC0603(1608)_N]
R102  RES_0603  value 49.9  Tolerance: 1%  [RESC0603(1608)_N]
R103  RES_0603  value 49.9  Tolerance: 1%  [RESC0603(1608)_N]
R104  RES_0603  value 49.9  Tolerance: 1%  [RESC0603(1608)_N]
R105  RES_0603  value 49.9  Tolerance: 1%  [RESC0603(1608)_N]
R106  RES_0603  value 49.9  Tolerance: 1%  [RESC0603(1608)_N]
R107  RES_0603  value 49.9  Tolerance: 1%  [RESC0603(1608)_N]
R108  RES_0603  value 49.9  Tolerance: 1%  [RESC0603(1608)_N]
R109  RES_0603  value 75  Tolerance: 5%  [RESC0603(1608)_N]
R110  RES_0603  value 75  Tolerance: 5%  [RESC0603(1608)_N]
R111  RES_0603  value 75  Tolerance: 5%  [RESC0603(1608)_N]
R112  RES_0603  value 75  Tolerance: 5%  [RESC0603(1608)_N]
R118  RES_0402  value 54.9  [RESC0402(1005)_N]
R119  RES_0402  value 54.9  [RESC0402(1005)_N]
U8  GigabitTransformer_Pulse_H6062NLT  Manufacturer: Pulse  [GigabitTransformer_H6062NLT_SOP-24]

### Ports
Eth1_LED (harness Eth1_LED), L1_OK, MDIO_ETH_1 (harness MDIO_ETHERNET1)

### Harnesses
MDIO_ETHERNET1: MDIA_P, MDIA_N, MDIB_P, MDIB_N, MDIC_P, MDIC_N, MDID_P, MDID_N
Eth1_LED: 1, 2

### Nets
GND: C202.1 C203.1 C204.1 C205.1
SHIELD: C206.1 C207.1 C208.1 C209.1 J2.M1(SHD) J2.M2(SHD)
VCC3V3: C202.2 C203.2 C204.2 C205.2 J2.14(LD_1P) J2.16(LD_2P) R101.2 R102.2 R103.2 R104.2 R105.2 R106.2 R107.2 R108.2 U8.1(TCT1) U8.4(TCT2) U8.7(TCT3) U8.10(TCT4)
A_D_N: J2.10(TRD_1N) U8.22(MX1_N)
A_D_P: J2.11(TRD_1P) U8.23(MX1_P)
Activity_LED_Eth1: R119.2 ; port Eth1_LED.1
B_D_N: J2.5(TRD_2N) U8.19(MX2_N)
B_D_P: J2.4(TRD_2P) U8.20(MX2_P)
C_D_N: J2.2(TRD_3N) U8.16(MX3_N)
C_D_P: J2.3(TRD_3P) U8.17(MX3_P)
CT1: J2.12(TRCT_1) J11.8 R109.2 U8.24(MCT1)
CT2: J2.6(TRCT_2) J11.6 R110.2 U8.21(MCT2)
CT3: J2.1(TRCT_3) J11.1 R112.2 U8.18(MCT3)
CT4: J2.7(TRCT_4) J11.3 R111.2 U8.15(MCT4)
D_D_N: J2.9(TRD_4N) U8.13(MX4_N)
D_D_P: J2.8(TRD_4P) U8.14(MX4_P)
Link1000_LED_Eth1: R118.2 ; port Eth1_LED.2
MDIA_N: R108.1 U8.3(TD1_N) ; port MDIO_ETH_1.MDIA_N
MDIA_P: R104.1 U8.2(TD1_P) ; port MDIO_ETH_1.MDIA_P
MDIB_N: R107.1 U8.6(TD2_N) ; port MDIO_ETH_1.MDIB_N
MDIB_P: R103.1 U8.5(TD2_P) ; port MDIO_ETH_1.MDIB_P
MDIC_N: R106.1 U8.9(TD3_N) ; port MDIO_ETH_1.MDIC_N
MDIC_P: R102.1 U8.8(TD3_P) ; port MDIO_ETH_1.MDIC_P
MDID_N: R105.1 U8.12(TD4_N) ; port MDIO_ETH_1.MDID_N
MDID_P: R101.1 U8.11(TC4_P) ; port MDIO_ETH_1.MDID_P
NetC206_2: C206.2 R109.1
NetC207_2: C207.2 R110.1
NetC208_2: C208.2 R111.1
NetC209_2: C209.2 R112.1
NetJ2_13: J2.13(LD_1N) R119.1
NetJ2_15: J2.15(LD_2N) R118.1
NetJ11_2: J11.2 ; port L1_OK

Not connected (* = marked no-connect by the designer): J11 4 5 7

### Layout directives
differential pair: A_D_N, A_D_P, B_D_N, B_D_P, C_D_N, C_D_P, D_D_N, D_D_P, MDIA_N, MDIA_P, MDIB_N, MDIB_P, MDIC_N, MDIC_P, MDID_N, MDID_P
mark named DIFF_100: A_D_N, A_D_P, B_D_N, B_D_P, C_D_N, C_D_P, D_D_N, D_D_P, MDIA_N, MDIA_P, MDIB_N, MDIB_P, MDIC_N, MDIC_P, MDID_N, MDID_P

### Notes on the sheet
- (in symbol L834-1G1T-S7) RJ-45 / (10/100/1000 Base-T)

### Library data of the parts
C202-C205 = C0603C104K5RACTU: CAP CER 0.1UF 50V 10% X7R 0603; Manufacturer: Kemet; Part Number: C0603C104K5RACTU; Footprint Ref: CAPC0603(1608)100_N; Library Ref: CAP_0603
C206-C209 = C0603C103K5RACTU: CAP CER 10000PF 50V 10% X7R 0603; Manufacturer: Kemet; Part Number: C0603C103K5RACTU; Footprint Ref: CAPC0603(1608)100_N; Library Ref: CAP_0603
J2 = L834-1G1T-S7: RJ-45, Belfuse, Gigabit Magnetic Jack; Part Number: L834-1G1T-S7; Manufacturer: Belfuse
J11 = 20021221-00008T4LF: CONN HEADER 8POS DUAL SHRD SMD; Manufacturer: FCI; Part Number: 20021221-00008T4LF
R101-R108 = ERJ-3EKF49R9V: RES 49.9 OHM 1/10W 1% 0603 SMD; Manufacturer: Panasonic Electronics Components; Part Number: ERJ-3EKF49R9V; Footprint Ref: RESC0603(1608)_N; Library Ref: RES_0603
R109-R112 = ERJ-3GEYJ750V: RES 75 OHM 1/10W 5% 0603 SMD; Manufacturer: Panasonic Electronic Components; Part Number: ERJ-3GEYJ750V; Footprint Ref: RESC0603(1608)_N; Library Ref: RES_0603
R118 R119 = ERJ-2RKF54R9X: RES 54.9 OHM 1/10W 1% 0402 SMD; Manufacturer: Panasonic Electronic Components; Tolerance: *; Part Number: ERJ-2RKF54R9X; Footprint Ref: RESC0402(1005)_N; Library Ref: RES_0402
U8 = H6062NLT: Magnetics, GigabitTransformer, H6062NLT, Pulse; Part Number: H6062NLT; Footprint Ref: GigabitTransformer_H6062NLT_SOP-24; Library Ref: GigabitTransformer_H6062NLT

## Sheet Ethernet1_Power.SchDoc
size A4; DocumentNumber: 23; SheetNumber: 23; SheetTotal: 47
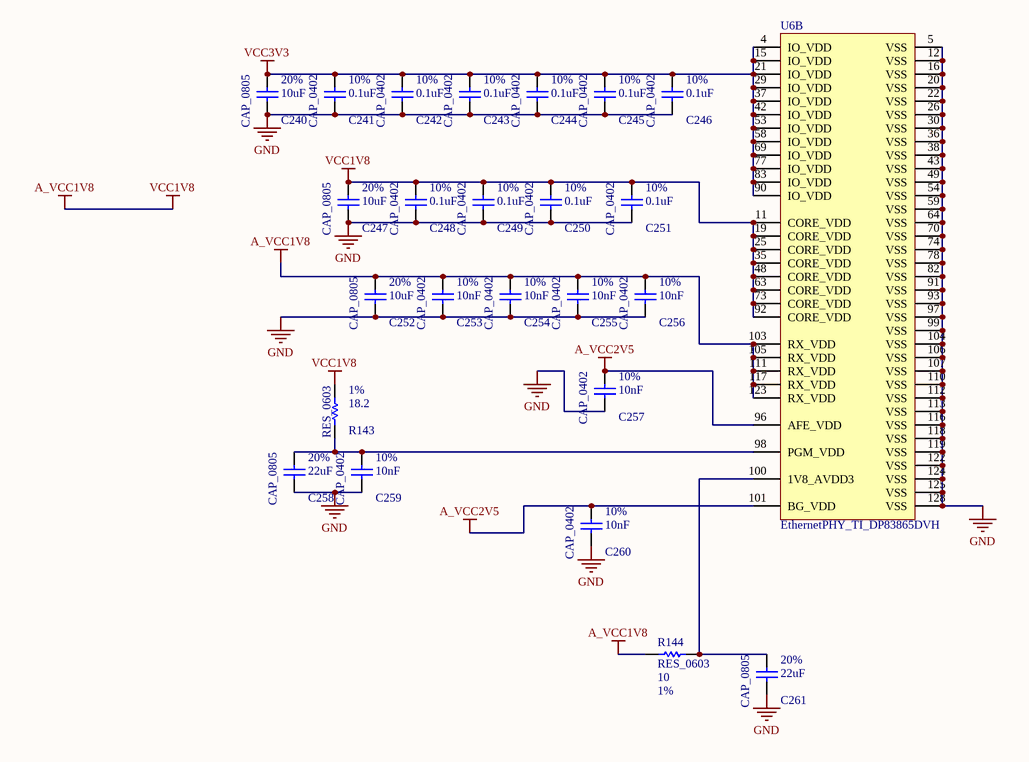
[diagram p14: Ethernet1_Power.SchDoc]

### Parts
C240  CAP_0805  value 10uF  Tolerance: 20%  [CAPC0805(2012)75_N]
C241  CAP_0402  value 0.1uF  Tolerance: 10%  [CAPC0402(1005)60_N]
C242  CAP_0402  value 0.1uF  Tolerance: 10%  [CAPC0402(1005)60_N]
C243  CAP_0402  value 0.1uF  Tolerance: 10%  [CAPC0402(1005)60_N]
C244  CAP_0402  value 0.1uF  Tolerance: 10%  [CAPC0402(1005)60_N]
C245  CAP_0402  value 0.1uF  Tolerance: 10%  [CAPC0402(1005)60_N]
C246  CAP_0402  value 0.1uF  Tolerance: 10%  [CAPC0402(1005)60_N]
C247  CAP_0805  value 10uF  Tolerance: 20%  [CAPC0805(2012)75_N]
C248  CAP_0402  value 0.1uF  Tolerance: 10%  [CAPC0402(1005)60_N]
C249  CAP_0402  value 0.1uF  Tolerance: 10%  [CAPC0402(1005)60_N]
C250  CAP_0402  value 0.1uF  Tolerance: 10%  [CAPC0402(1005)60_N]
C251  CAP_0402  value 0.1uF  Tolerance: 10%  [CAPC0402(1005)60_N]
C252  CAP_0805  value 10uF  Tolerance: 20%  [CAPC0805(2012)75_N]
C253  CAP_0402  value 10nF  Tolerance: 10%  [CAPC0402(1005)60_N]
C254  CAP_0402  value 10nF  Tolerance: 10%  [CAPC0402(1005)60_N]
C255  CAP_0402  value 10nF  Tolerance: 10%  [CAPC0402(1005)60_N]
C256  CAP_0402  value 10nF  Tolerance: 10%  [CAPC0402(1005)60_N]
C257  CAP_0402  value 10nF  Tolerance: 10%  [CAPC0402(1005)60_N]
C258  CAP_0805  value 22uF  Tolerance: 20%  [CAPC0805(2012)75_N]
C259  CAP_0402  value 10nF  Tolerance: 10%  [CAPC0402(1005)60_N]
C260  CAP_0402  value 10nF  Tolerance: 10%  [CAPC0402(1005)60_N]
C261  CAP_0805  value 22uF  Tolerance: 20%  [CAPC0805(2012)75_N]
R143  RES_0603  value 18.2  Tolerance: 1%  [RESC0603(1608)_N]
R144  RES_0603  value 10  Tolerance: 1%  [RESC0603(1608)_N]
U6  EthernetPHY_TI_DP83865DVH  [EthernetPHY_TI_DP83865(PQFP)_VLA128A_N]  (part B of 2)

### Nets
A_VCC1V8: C247.2 C248.2 C249.2 C250.2 C251.2 C252.2 C253.2 C254.2 C255.2 C256.2 R143.2 R144.2 U6.11(CORE_VDD) U6.19(CORE_VDD) U6.25(CORE_VDD) U6.35(CORE_VDD) U6.48(CORE_VDD) U6.63(CORE_VDD) U6.73(CORE_VDD) U6.92(CORE_VDD) U6.103(RX_VDD) U6.105(RX_VDD) U6.111(RX_VDD) U6.117(RX_VDD) U6.123(RX_VDD)  [also labelled VCC1V8]
A_VCC2V5: C257.2 C260.2 U6.96(AFE_VDD) U6.101(BG_VDD)
GND: C240.1 C241.1 C242.1 C243.1 C244.1 C245.1 C246.1 C247.1 C248.1 C249.1 C250.1 C251.1 C252.1 C253.1 C254.1 C255.1 C256.1 C257.1 C258.1 C259.1 C260.1 C261.1 U6.5(VSS) U6.12(VSS) U6.16(VSS) U6.20(VSS) U6.22(VSS) U6.26(VSS) U6.30(VSS) U6.36(VSS) U6.38(VSS) U6.43(VSS) U6.49(VSS) U6.54(VSS) U6.59(VSS) U6.64(VSS) U6.70(VSS) U6.74(VSS) U6.78(VSS) U6.82(VSS) U6.91(VSS) U6.93(VSS) U6.97(VSS) U6.99(VSS) U6.104(VSS) U6.106(VSS) U6.107(VSS) U6.110(VSS) U6.112(VSS) U6.113(VSS) U6.116(VSS) U6.118(VSS) U6.119(VSS) U6.122(VSS) U6.124(VSS) U6.125(VSS) U6.128(VSS)
VCC3V3: C240.2 C241.2 C242.2 C243.2 C244.2 C245.2 C246.2 U6.4(IO_VDD) U6.15(IO_VDD) U6.21(IO_VDD) U6.29(IO_VDD) U6.37(IO_VDD) U6.42(IO_VDD) U6.53(IO_VDD) U6.58(IO_VDD) U6.69(IO_VDD) U6.77(IO_VDD) U6.83(IO_VDD) U6.90(IO_VDD)
NetC258_2: C258.2 C259.2 R143.1 U6.98(PGM_VDD)
NetC261_2: C261.2 R144.1 U6.100(1V8_AVDD3)

### Library data of the parts
C240 C247 C252 = ECJ-2FB0J106M: 10uF, ceramic, 20%, 6.3V, X5R 0805; Manufacturer: Panasonic - ECG; Part Number: ECJ-2FB0J106M; Footprint Ref: CAPC0805(2012)75_N; Library Ref: CAP_0805
C241-C246 C248-C251 = CAP_0402: 0.1uf, ceramic, 10%, 6.3V, X5R, 0402; Part Number: C1005X5R0J104K; Manufacturer: TDK Corporation; Footprint Ref: CAPC0402(1005)60_N; Library Ref: CAP_0402
C253-C257 C259 C260 = CAP_0402: 10000pF, ceramic, 10% 6.3V X5R, 0402; Part Number: GRM155R60J103KA01D; Manufacturer: Murata Electronics North America; Footprint Ref: CAPC0402(1005)60_N; Library Ref: CAP_0402
C258 C261 = JMK212BJ226MG-T: 22uF, ceramic, 20%, 6.3V, X5R, 0805; Manufacturer: Taiyo Yuden; Part Number: JMK212BJ226MG-T; Footprint Ref: CAPC0805(2012)75_N; Library Ref: CAP_0805
R143 = ERJ-3EKF18R2V: RES 18.2 OHM 1/10W 1% 0603 SMD; Manufacturer: Panasonic Electronics Components; Part Number: ERJ-3EKF18R2V; Footprint Ref: RESC0603(1608)_N; Library Ref: RES_0603
R144 = ERJ-3EKF10R0V: RES 10.0 OHM 1/10W 1% 0603 SMD; Manufacturer: Panasonic Electronics Components; Part Number: ERJ-3EKF10R0V; Footprint Ref: RESC0603(1608)_N; Library Ref: RES_0603
U6 = DP83865DVH: as U6 on sheet Ethernet1; Part Number: DP83865DVH

## Sheet Ethernet2.SchDoc
size A4; DocumentNumber: 17; SheetNumber: 17; SheetTotal: 47
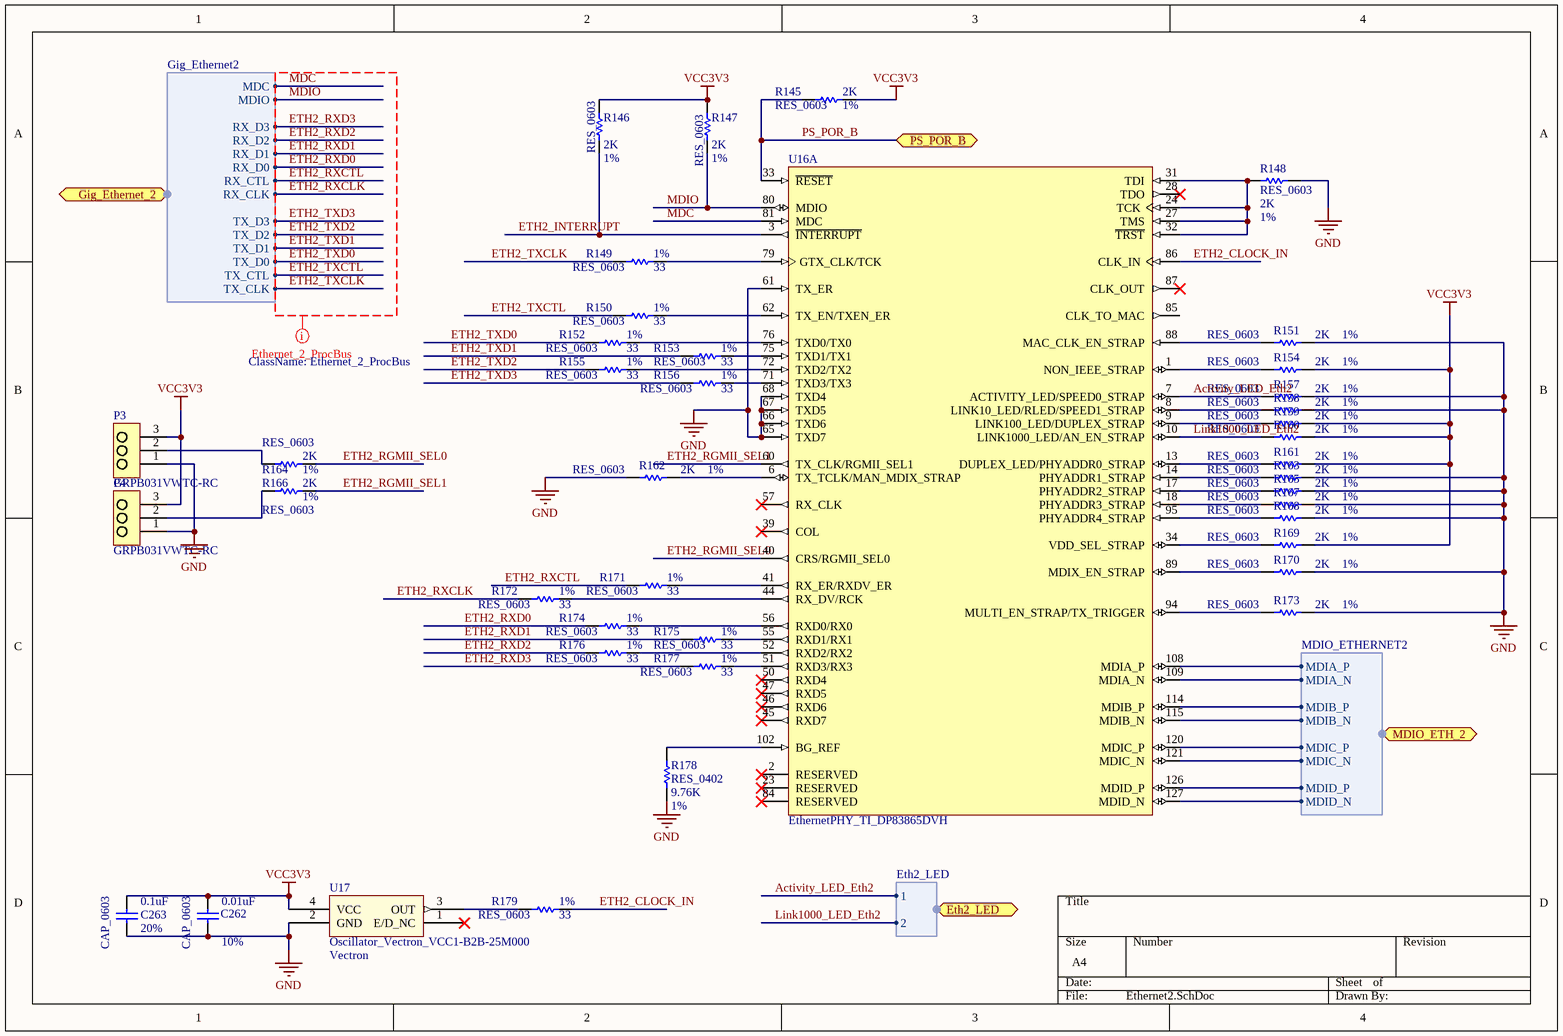
[diagram p15: Ethernet2.SchDoc]

### Parts
C262  CAP_0603  value 0.01uF  Tolerance: 10%  [CAPC0603(1608)100_N]
C263  CAP_0603  value 0.1uF  Tolerance: 20%  [CAPC0603(1608)100_N]
P3  GRPB031VWTC-RC  [Header_3-Pos_Sullins_GRPB031VWTC-RC]
P4  GRPB031VWTC-RC  [Header_3-Pos_Sullins_GRPB031VWTC-RC]
R145  RES_0603  value 2K  Tolerance: 1%  [RESC0603(1608)_N]
R146  RES_0603  value 2K  Tolerance: 1%  [RESC0603(1608)_N]
R147  RES_0603  value 2K  Tolerance: 1%  [RESC0603(1608)_N]
R148  RES_0603  value 2K  Tolerance: 1%  [RESC0603(1608)_N]
R149  RES_0603  value 33  Tolerance: 1%  [RESC0603(1608)_N]
R150  RES_0603  value 33  Tolerance: 1%  [RESC0603(1608)_N]
R151  RES_0603  value 2K  Tolerance: 1%  [RESC0603(1608)_N]
R152  RES_0603  value 33  Tolerance: 1%  [RESC0603(1608)_N]
R153  RES_0603  value 33  Tolerance: 1%  [RESC0603(1608)_N]
R154  RES_0603  value 2K  Tolerance: 1%  [RESC0603(1608)_N]
R155  RES_0603  value 33  Tolerance: 1%  [RESC0603(1608)_N]
R156  RES_0603  value 33  Tolerance: 1%  [RESC0603(1608)_N]
R157  RES_0603  value 2K  Tolerance: 1%  [RESC0603(1608)_N]
R158  RES_0603  value 2K  Tolerance: 1%  [RESC0603(1608)_N]
R159  RES_0603  value 2K  Tolerance: 1%  [RESC0603(1608)_N]
R160  RES_0603  value 2K  Tolerance: 1%  [RESC0603(1608)_N]
R161  RES_0603  value 2K  Tolerance: 1%  [RESC0603(1608)_N]
R162  RES_0603  value 2K  Tolerance: 1%  [RESC0603(1608)_N]
R163  RES_0603  value 2K  Tolerance: 1%  [RESC0603(1608)_N]
R164  RES_0603  value 2K  Tolerance: 1%  [RESC0603(1608)_N]
R165  RES_0603  value 2K  Tolerance: 1%  [RESC0603(1608)_N]
R166  RES_0603  value 2K  Tolerance: 1%  [RESC0603(1608)_N]
R167  RES_0603  value 2K  Tolerance: 1%  [RESC0603(1608)_N]
R168  RES_0603  value 2K  Tolerance: 1%  [RESC0603(1608)_N]
R169  RES_0603  value 2K  Tolerance: 1%  [RESC0603(1608)_N]
R170  RES_0603  value 2K  Tolerance: 1%  [RESC0603(1608)_N]
R171  RES_0603  value 33  Tolerance: 1%  [RESC0603(1608)_N]
R172  RES_0603  value 33  Tolerance: 1%  [RESC0603(1608)_N]
R173  RES_0603  value 2K  Tolerance: 1%  [RESC0603(1608)_N]
R174  RES_0603  value 33  Tolerance: 1%  [RESC0603(1608)_N]
R175  RES_0603  value 33  Tolerance: 1%  [RESC0603(1608)_N]
R176  RES_0603  value 33  Tolerance: 1%  [RESC0603(1608)_N]
R177  RES_0603  value 33  Tolerance: 1%  [RESC0603(1608)_N]
R178  RES_0402  value 9.76K  Tolerance: 1%  [RESC0402(1005)_N]
R179  RES_0603  value 33  Tolerance: 1%  [RESC0603(1608)_N]
U16  EthernetPHY_TI_DP83865DVH  [EthernetPHY_TI_DP83865(PQFP)_VLA128A_N]  (part A of 2)
U17  Oscillator_Vectron_VCC1-B2B-25M000  Manufacturer: Vectron  [Oscillator_Vectron_VCC1-B2B-25M000_SMD]

### Ports
Eth2_LED (harness Eth2_LED), Gig_Ethernet_2 (harness Gig_Ethernet2), MDIO_ETH_2 (harness MDIO_ETHERNET2), PS_POR_B (bidir)

### Harnesses
MDIO_ETHERNET2: MDIA_P, MDIA_N, MDIB_P, MDIB_N, MDIC_P, MDIC_N, MDID_P, MDID_N
Gig_Ethernet2: TX_CLK, TX_CTL, TX_D0, TX_D1, TX_D2, TX_D3, RX_D0, RX_D1, RX_D2, RX_D3, RX_CLK, RX_CTL, MDIO, MDC
Eth2_LED: 1, 2

### Nets
GND: C262.1 C263.2 P3.1 P4.1 R148.1 R151.1 R157.1 R158.1 R162.2 R163.1 R165.1 R167.1 R168.1 R170.1 R173.1 R178.1 U16.61(TX_ER) U16.65(TXD7) U16.66(TXD6) U16.67(TXD5) U16.68(TXD4) U17.2(GND)
VCC3V3: C262.2 C263.1 P3.3 P4.3 R145.1 R146.2 R147.2 R154.1 R159.1 R160.1 R161.1 R169.1 U17.4(VCC)
Activity_LED_Eth2: R157.2 U16.7(ACTIVITY_LED/SPEED0_STRAP) ; port Eth2_LED.1
ETH2_CLOCK_IN: R179.2 U16.86(CLK_IN)
ETH2_INTERRUPT: R146.1 U16.3(~{INTERRUPT})
ETH2_MDIA_N: U16.109(MDIA_N) ; port MDIO_ETH_2.MDIA_N
ETH2_MDIA_P: U16.108(MDIA_P) ; port MDIO_ETH_2.MDIA_P
ETH2_MDIB_N: U16.115(MDIB_N) ; port MDIO_ETH_2.MDIB_N
ETH2_MDIB_P: U16.114(MDIB_P) ; port MDIO_ETH_2.MDIB_P
ETH2_MDIC_N: U16.121(MDIC_N) ; port MDIO_ETH_2.MDIC_N
ETH2_MDIC_P: U16.120(MDIC_P) ; port MDIO_ETH_2.MDIC_P
ETH2_MDID_N: U16.127(MDID_N) ; port MDIO_ETH_2.MDID_N
ETH2_MDID_P: U16.126(MDID_P) ; port MDIO_ETH_2.MDID_P
ETH2_RGMII_SEL0: R164.1 U16.40(CRS/RGMII_SEL0)
ETH2_RGMII_SEL1: R166.1 U16.60(TX_CLK/RGMII_SEL1)
ETH2_RXCLK: R172.1 ; port Gig_Ethernet_2.RX_CLK
ETH2_RXCTL: R171.1 ; port Gig_Ethernet_2.RX_CTL
ETH2_RXD0: R174.1 ; port Gig_Ethernet_2.RX_D0
ETH2_RXD1: R175.1 ; port Gig_Ethernet_2.RX_D1
ETH2_RXD2: R176.1 ; port Gig_Ethernet_2.RX_D2
ETH2_RXD3: R177.1 ; port Gig_Ethernet_2.RX_D3
ETH2_TXCLK: R149.1 ; port Gig_Ethernet_2.TX_CLK
ETH2_TXCTL: R150.1 ; port Gig_Ethernet_2.TX_CTL
ETH2_TXD0: R152.1 ; port Gig_Ethernet_2.TX_D0
ETH2_TXD1: R153.1 ; port Gig_Ethernet_2.TX_D1
ETH2_TXD2: R155.1 ; port Gig_Ethernet_2.TX_D2
ETH2_TXD3: R156.1 ; port Gig_Ethernet_2.TX_D3
Link1000_LED_Eth2: R160.2 U16.10(LINK1000_LED/AN_EN_STRAP) ; port Eth2_LED.2
MDC: U16.81(MDC) ; port Gig_Ethernet_2.MDC
MDIO: R147.1 U16.80(MDIO) ; port Gig_Ethernet_2.MDIO
PS_POR_B: R145.2 U16.33(~{RESET}) ; port PS_POR_B
NetP3_2: P3.2 R164.2
NetP4_2: P4.2 R166.2
NetR148_2: R148.2 U16.24(TCK) U16.27(TMS) U16.31(TDI) U16.32(~{TRST})
NetR149_2: R149.2 U16.79(GTX_CLK/TCK)
NetR150_2: R150.2 U16.62(TX_EN/TXEN_ER)
NetR151_2: R151.2 U16.88(MAC_CLK_EN_STRAP)
NetR152_2: R152.2 U16.76(TXD0/TX0)
NetR153_2: R153.2 U16.75(TXD1/TX1)
NetR154_2: R154.2 U16.1(NON_IEEE_STRAP)
NetR155_2: R155.2 U16.72(TXD2/TX2)
NetR156_2: R156.2 U16.71(TXD3/TX3)
NetR158_2: R158.2 U16.8(LINK10_LED/RLED/SPEED1_STRAP)
NetR159_2: R159.2 U16.9(LINK100_LED/DUPLEX_STRAP)
NetR161_2: R161.2 U16.13(DUPLEX_LED/PHYADDR0_STRAP)
NetR162_1: R162.1 U16.6(TX_TCLK/MAN_MDIX_STRAP)
NetR163_2: R163.2 U16.14(PHYADDR1_STRAP)
NetR165_2: R165.2 U16.17(PHYADDR2_STRAP)
NetR167_2: R167.2 U16.18(PHYADDR3_STRAP)
NetR168_2: R168.2 U16.95(PHYADDR4_STRAP)
NetR169_2: R169.2 U16.34(VDD_SEL_STRAP)
NetR170_2: R170.2 U16.89(MDIX_EN_STRAP)
NetR171_2: R171.2 U16.41(RX_ER/RXDV_ER)
NetR172_2: R172.2 U16.44(RX_DV/RCK)
NetR173_2: R173.2 U16.94(MULTI_EN_STRAP/TX_TRIGGER)
NetR174_2: R174.2 U16.56(RXD0/RX0)
NetR175_2: R175.2 U16.55(RXD1/RX1)
NetR176_2: R176.2 U16.52(RXD2/RX2)
NetR177_2: R177.2 U16.51(RXD3/RX3)
NetR178_2: R178.2 U16.102(BG_REF)
NetR179_1: R179.1 U17.3(OUT)

Not connected (* = marked no-connect by the designer): U16 2(RESERVED)* 23(RESERVED)* 28(TDO)* 39(COL)* 45(RXD7)* 46(RXD6)* 47(RXD5)* 50(RXD4)* 57(RX_CLK)* 84(RESERVED)* 85(CLK_TO_MAC) 87(CLK_OUT)*; U17 1(E/D_NC)*

### Layout directives
net class Ethernet_2_ProcBus: ETH2_RXCLK, ETH2_RXCTL, ETH2_RXD0, ETH2_RXD1, ETH2_RXD2, ETH2_RXD3, ETH2_TXCLK, ETH2_TXCTL, ETH2_TXD0, ETH2_TXD1, ETH2_TXD2, ETH2_TXD3, MDC, MDIO

### Library data of the parts
C262 = C0603C103K9RACTU: as C200 on sheet Ethernet1; Part Number: C0603C103K9RACTU; Footprint Ref: CAPC0603(1608)100_N; Library Ref: CAP_0603
C263 = 6R3X14W104MV4T: as C201 on sheet Ethernet1; Part Number: 6R3X14W104MV4T; Footprint Ref: CAPC0603(1608)100_N; Library Ref: CAP_0603
P3 P4 = GRPB031VWTC-RC: as P1 on sheet Ethernet1; Part Number: GRPB031VWTC-RC
R145-R148 R151 R154 R157-R170 R173 = ERJ-3EKF2001V: as R66 on sheet Ethernet1; Part Number: ERJ-3EKF2001V; Footprint Ref: RESC0603(1608)_N; Library Ref: RES_0603
R149 R150 R152 R153 R155 R156 R171 R172 R174-R177 R179 = ERJ-3EKF33R0V: as R70 on sheet Ethernet1; Part Number: ERJ-3EKF33R0V; Footprint Ref: RESC0603(1608)_N; Library Ref: RES_0603
R178 = CRCW04029K76FKED: as R99 on sheet Ethernet1; Part Number: CRCW04029K76FKED; Footprint Ref: RESC0402(1005)_N; Library Ref: RES_0402
U16 = DP83865DVH: as U6 on sheet Ethernet1; Part Number: DP83865DVH
U17 = VCC1-B2B-25M000: as U7 on sheet Ethernet1; Part Number: VCC1-B2B-25M000; Footprint Ref: Oscillator_Vectron_VCC1-B2B-25M000_SMD; Library Ref: Oscillator_Vectron_VCC1-B2B-25M000

## Sheet Ethernet2_MDIO.SchDoc
size A4; DocumentNumber: 18; SheetNumber: 18; SheetTotal: 47
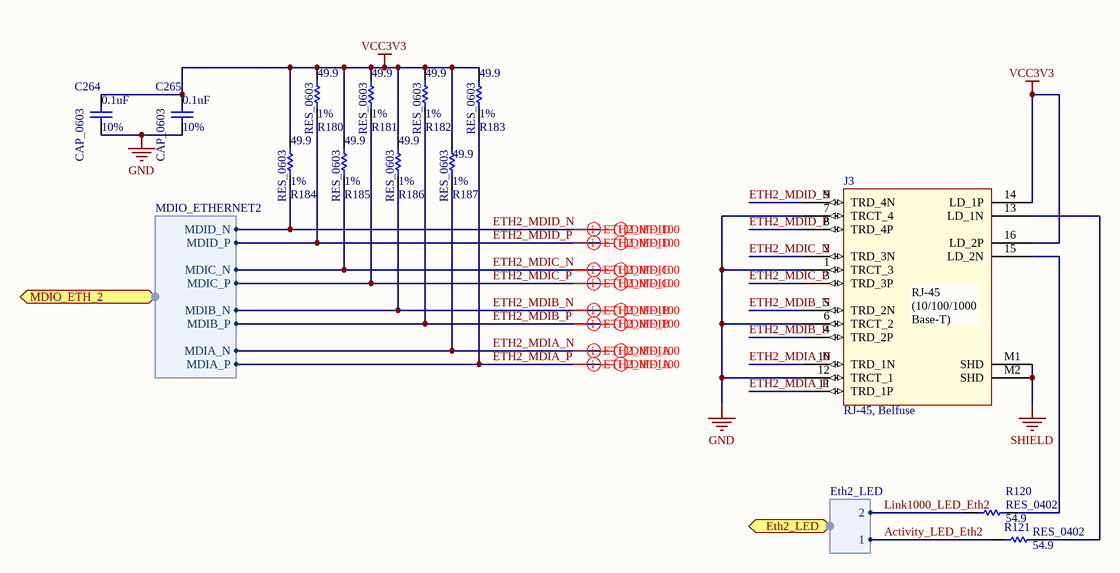
[diagram p16: Ethernet2_MDIO.SchDoc]

### Parts
C264  CAP_0603  value 0.1uF  Tolerance: 10%  [CAPC0603(1608)100_N]
C265  CAP_0603  value 0.1uF  Tolerance: 10%  [CAPC0603(1608)100_N]
J3  RJ-45, Belfuse  [RJ-45_BelFuse_L834-1G1T-S7_pcb]
R120  RES_0402  value 54.9  [RESC0402(1005)_N]
R121  RES_0402  value 54.9  [RESC0402(1005)_N]
R180  RES_0603  value 49.9  Tolerance: 1%  [RESC0603(1608)_N]
R181  RES_0603  value 49.9  Tolerance: 1%  [RESC0603(1608)_N]
R182  RES_0603  value 49.9  Tolerance: 1%  [RESC0603(1608)_N]
R183  RES_0603  value 49.9  Tolerance: 1%  [RESC0603(1608)_N]
R184  RES_0603  value 49.9  Tolerance: 1%  [RESC0603(1608)_N]
R185  RES_0603  value 49.9  Tolerance: 1%  [RESC0603(1608)_N]
R186  RES_0603  value 49.9  Tolerance: 1%  [RESC0603(1608)_N]
R187  RES_0603  value 49.9  Tolerance: 1%  [RESC0603(1608)_N]

### Ports
Eth2_LED (harness Eth2_LED), MDIO_ETH_2 (harness MDIO_ETHERNET2)

### Harnesses
MDIO_ETHERNET2: MDIA_P, MDIA_N, MDIB_P, MDIB_N, MDIC_P, MDIC_N, MDID_P, MDID_N
Eth2_LED: 1, 2

### Nets
GND: C264.1 C265.1 J3.1(TRCT_3) J3.6(TRCT_2) J3.7(TRCT_4) J3.12(TRCT_1)
SHIELD: J3.M1(SHD) J3.M2(SHD)
VCC3V3: C264.2 C265.2 J3.14(LD_1P) J3.16(LD_2P) R180.2 R181.2 R182.2 R183.2 R184.2 R185.2 R186.2 R187.2
Activity_LED_Eth2: R121.2 ; port Eth2_LED.1
ETH2_MDIA_N: J3.10(TRD_1N) R187.1 ; port MDIO_ETH_2.MDIA_N
ETH2_MDIA_P: J3.11(TRD_1P) R183.1 ; port MDIO_ETH_2.MDIA_P
ETH2_MDIB_N: J3.5(TRD_2N) R186.1 ; port MDIO_ETH_2.MDIB_N
ETH2_MDIB_P: J3.4(TRD_2P) R182.1 ; port MDIO_ETH_2.MDIB_P
ETH2_MDIC_N: J3.2(TRD_3N) R185.1 ; port MDIO_ETH_2.MDIC_N
ETH2_MDIC_P: J3.3(TRD_3P) R181.1 ; port MDIO_ETH_2.MDIC_P
ETH2_MDID_N: J3.9(TRD_4N) R184.1 ; port MDIO_ETH_2.MDID_N
ETH2_MDID_P: J3.8(TRD_4P) R180.1 ; port MDIO_ETH_2.MDID_P
Link1000_LED_Eth2: R120.2 ; port Eth2_LED.2
NetJ3_13: J3.13(LD_1N) R121.1
NetJ3_15: J3.15(LD_2N) R120.1

### Layout directives
differential pair: ETH2_MDIA_N, ETH2_MDIA_P, ETH2_MDIB_N, ETH2_MDIB_P, ETH2_MDIC_N, ETH2_MDIC_P, ETH2_MDID_N, ETH2_MDID_P
mark named DIFF_100: ETH2_MDIA_N, ETH2_MDIA_P, ETH2_MDIB_N, ETH2_MDIB_P, ETH2_MDIC_N, ETH2_MDIC_P, ETH2_MDID_N, ETH2_MDID_P

### Notes on the sheet
- (in symbol L834-1G1T-S7) RJ-45 / (10/100/1000 Base-T)

### Library data of the parts
C264 C265 = C0603C104K5RACTU: as C202 on sheet Ethernet1_MDIO; Part Number: C0603C104K5RACTU; Footprint Ref: CAPC0603(1608)100_N; Library Ref: CAP_0603
J3 = L834-1G1T-S7: RJ-45, Belfuse, Gigabit Magnetic Jack; Part Number: L834-1G1T-S7; Manufacturer: Belfuse
R120 R121 = ERJ-2RKF54R9X: as R118 on sheet Ethernet1_MDIO; Tolerance: *; Part Number: ERJ-2RKF54R9X; Footprint Ref: RESC0402(1005)_N; Library Ref: RES_0402
R180-R187 = ERJ-3EKF49R9V: as R101 on sheet Ethernet1_MDIO; Part Number: ERJ-3EKF49R9V; Footprint Ref: RESC0603(1608)_N; Library Ref: RES_0603